# EAGLE schematic Dashboard_2.1 (EAGLE 9.2.2)

## Sheet 1 of 8: MCU
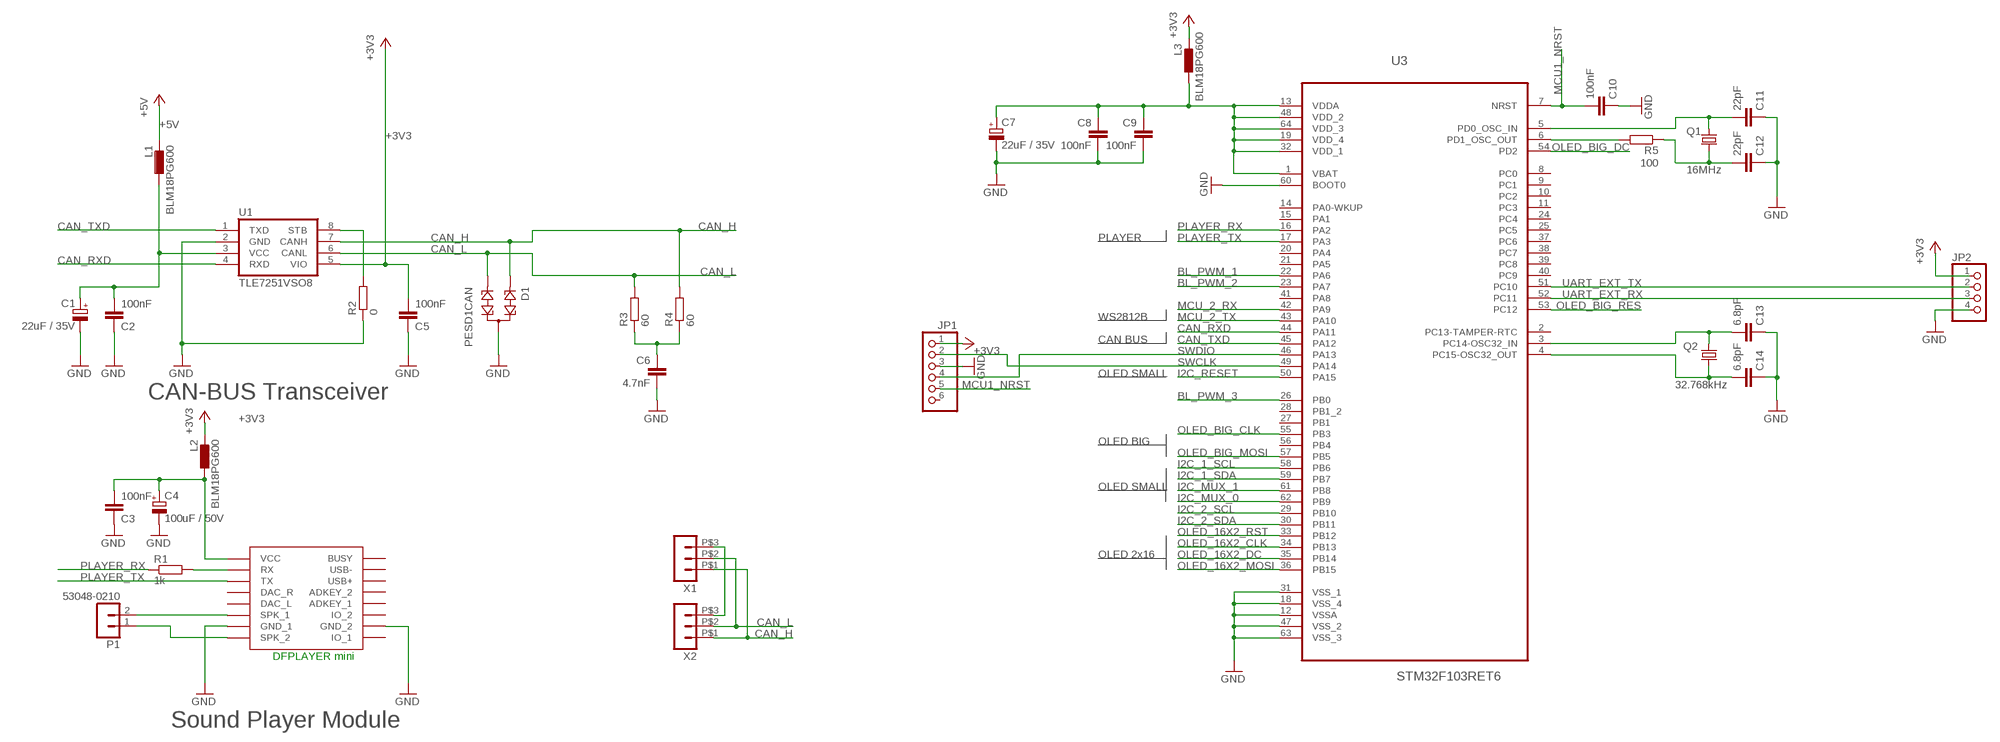
[diagram p0: schematic, sheet 1]

### Parts
C1  22uF / 35V  CPOL-EUSMCD  [SMC_D]
C2  100nF  C-EUC0805K  [C0805K]
C3  100nF  C-EUC0805K  [C0805K]
C4  100uF / 50V  CPOL-EUF  [PANASONIC_F]
C5  100nF  C-EUC0805K  [C0805K]
C6  4.7nF  C-EUC0805K  [C0805K]
C7  22uF / 35V  CPOL-EUSMCD  [SMC_D]
C8  100nF  C-EUC0805K  [C0805K]
C9  100nF  C-EUC0805K  [C0805K]
C10  100nF  C-EUC0805K  [C0805K]
C11  22pF  C-EUC0805K  [C0805K]
C12  22pF  C-EUC0805K  [C0805K]
C13  6.8pF  C-EUC0805K  [C0805K]
C14  6.8pF  C-EUC0805K  [C0805K]
D1  PESD1CAN  [SOT23]
JP1  PINHD-1X6  [1X06]
JP2  PINHD-1X4  [1X04]
L1  BLM18PG600  L_EU_L0603  [L1608]
L2  BLM18PG600  L_EU_L0603  [L1608]
L3  BLM18PG600  L_EU_L0603  [L1608]
P1  53048-0210  [53048-0210]
Q1  16MHz  CRYSTALSM49  [SM49]
Q2  32.768kHz  MC-306  [SMD4_270]
R1  1k  R-EU_R0805  [R0805]
R2  0  R-EU_R0805  [R0805]
R3  60  R-EU_R0805  [R0805]
R4  60  R-EU_R0805  [R0805]
R5  100  R-EU_R0805  [R0805]
U1  TLE7251VSO8  [SO8]
U2  DFPLAYER  [DFPLAYER]
U3  STM32F103RET6  [QFP50P1200X1200X160-64N]
X1  HEADER_POS3_43650-0315  [43650-0315]
X2  HEADER_POS3_43650-0315  [43650-0315]

### Nets
+3V3: C5.2 JP1.1 JP2.1 L2.2 L3.2 U1.5(VIO) ; also sheet 3,4,5,6,7,8
+5V: L1.2 ; also sheet 2,3,4,5
BL_PWM_1: U3.22(PA6) ; also sheet 3
BL_PWM_2: U3.23(PA7) ; also sheet 3
BL_PWM_3: U3.26(PB0) ; also sheet 3
CAN_H: D1.1 R4.2 U1.7(CANH) X1.P$1 X2.P$1
CAN_L: D1.2 R3.2 U1.6(CANL) X1.P$2 X2.P$2
CAN_RXD: U1.4(RXD) U3.44(PA11)
CAN_STB: R2.2 U1.8(STB)
CAN_TXD: U1.1(TXD) U3.45(PA12)
GND: C1.- C2.1 C3.1 C4.- C5.1 C6.2 C7.- C8.2 C9.2 C10.1 C11.1 C12.1 C13.1 C14.1 D1.3 JP1.3 JP2.4 R2.1 U1.2(GND) U2.GND_1 U2.GND_2 U3.12(VSSA) U3.18(VSS_4) U3.31(VSS_1) U3.47(VSS_2) U3.60(BOOT0) U3.63(VSS_3) ; also sheet 2,3,4,5,6,7,8
I2C_1_SCL: U3.58(PB6) ; also sheet 6
I2C_1_SDA: U3.59(PB7) ; also sheet 6
I2C_2_SCL: U3.29(PB10)
I2C_2_SDA: U3.30(PB11)
I2C_MUX_0: U3.62(PB9) ; also sheet 6
I2C_MUX_1: U3.61(PB8) ; also sheet 6
I2C_RESET: U3.50(PA15) ; also sheet 6
MCU1_NRST: C10.2 JP1.5 U3.7(NRST)
MCU_2_RX: U3.42(PA9) ; also sheet 5
MCU_2_TX: U3.43(PA10) ; also sheet 5
N$16: R5.2 U3.6(PD1_OSC_OUT)
N$22: R1.2 U2.RX
N$23: C3.2 C4.+ L2.1 U2.VCC
N$49: X1.P$3 X2.P$3
N$58: P1.1 U2.SPK2(SPK_2)
N$59: C6.1 R3.1 R4.1
N$61: C7.+ C8.1 C9.1 L3.1 U3.1(VBAT) U3.13(VDDA) U3.19(VDD_4) U3.32(VDD_1) U3.48(VDD_2) U3.64(VDD_3)
N$64: P1.2 U2.SPK1(SPK_1)
N$87: C11.2 Q1.1 U3.5(PD0_OSC_IN)
N$88: C12.2 Q1.2 R5.1
N$104: C13.2 Q2.4 U3.3(PC14-OSC32_IN)
N$108: C14.2 Q2.1 U3.4(PC15-OSC32_OUT)
N$113: C1.+ C2.2 L1.1 U1.3(VCC)
OLED_16X2_CLK: U3.34(PB13) ; also sheet 7
OLED_16X2_DC: U3.35(PB14) ; also sheet 7
OLED_16X2_MOSI: U3.36(PB15) ; also sheet 7
OLED_16X2_RST: U3.33(PB12) ; also sheet 7
OLED_BIG_CLK: U3.55(PB3) ; also sheet 8
OLED_BIG_DC: U3.54(PD2) ; also sheet 8
OLED_BIG_MOSI: U3.57(PB5) ; also sheet 8
OLED_BIG_RES: U3.53(PC12) ; also sheet 8
PLAYER_RX: R1.1 U3.16(PA2)
PLAYER_TX: U2.TX U3.17(PA3)
SWCLK: JP1.2 U3.49(PA14)
SWDIO: JP1.4 U3.46(PA13)
UART_EXT_RX: JP2.3 U3.52(PC11)
UART_EXT_TX: JP2.2 U3.51(PC10)
Unconnected: JP1.6 U2.ADKEY1(ADKEY_1) U2.ADKEY2(ADKEY_2) U2.BUSY U2.DAC_L U2.DAC_R U2.IO1(IO_1) U2.IO2(IO_2) U2.USB+ U2.USB- U3.2(PC13-TAMPER-RTC) U3.8(PC0) U3.9(PC1) U3.10(PC2) U3.11(PC3) U3.14(PA0-WKUP) U3.15(PA1) U3.20(PA4) U3.21(PA5) U3.24(PC4) U3.25(PC5) U3.27(PB1) U3.28(PB1_2) U3.37(PC6) U3.38(PC7) U3.39(PC8) U3.40(PC9) U3.41(PA8) U3.56(PB4)

### Notes on the sheet
- PLAYER
- WS2812B
- CAN BUS
- OLED SMALL
- CAN-BUS Transceiver
- OLED BIG
- OLED SMALL
- OLED 2x16
- DFPLAYER mini
- Sound Player Module

## Sheet 2 of 8: WS2812b arrays
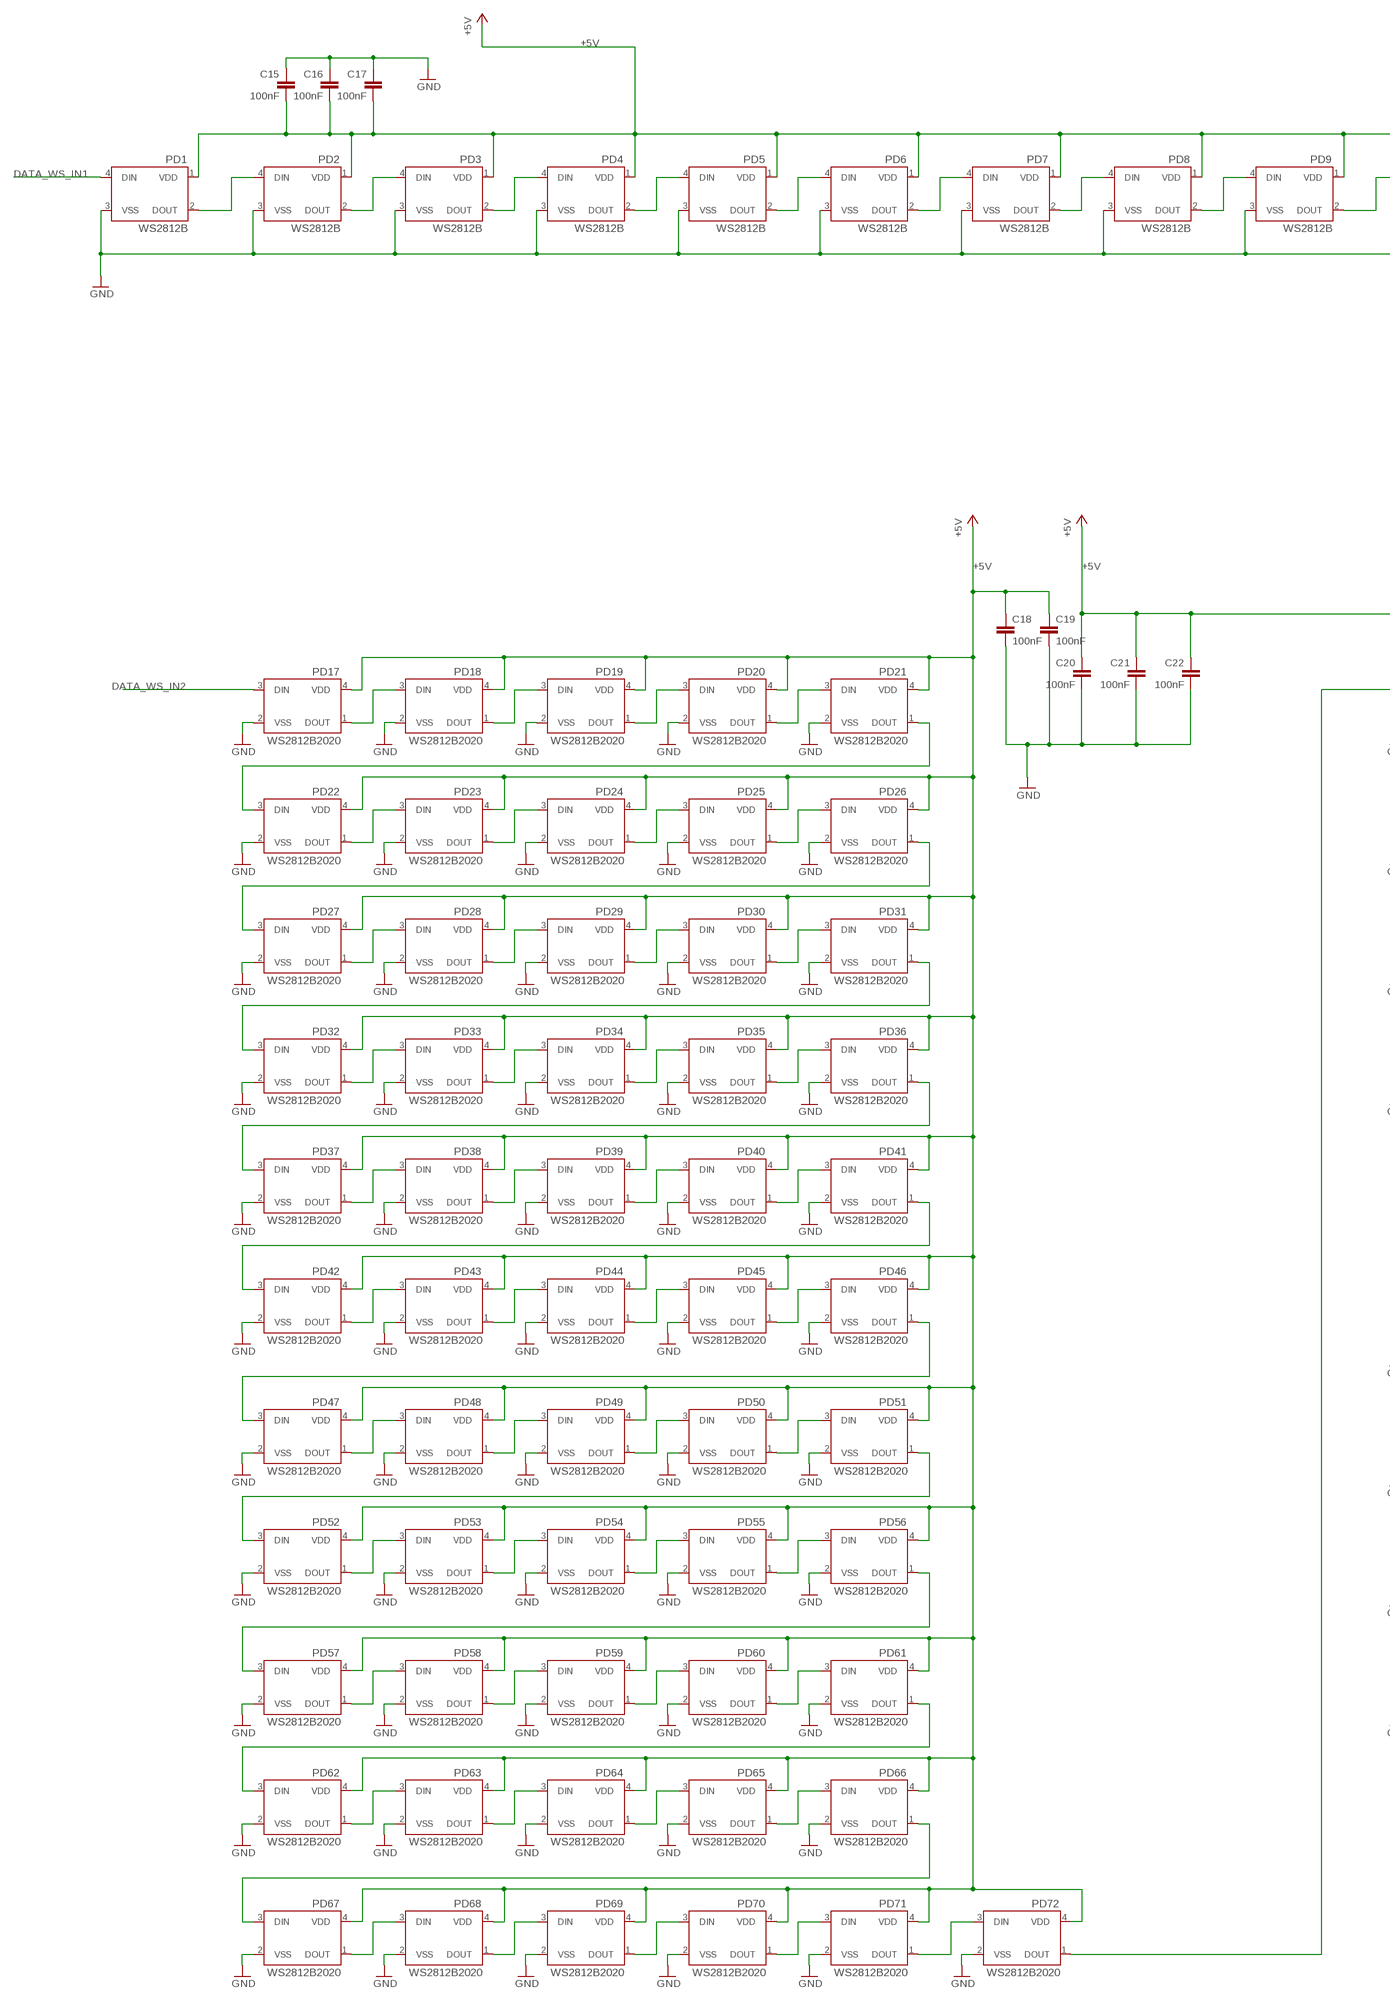
[diagram p1: schematic, sheet 2, part 1 of 2]
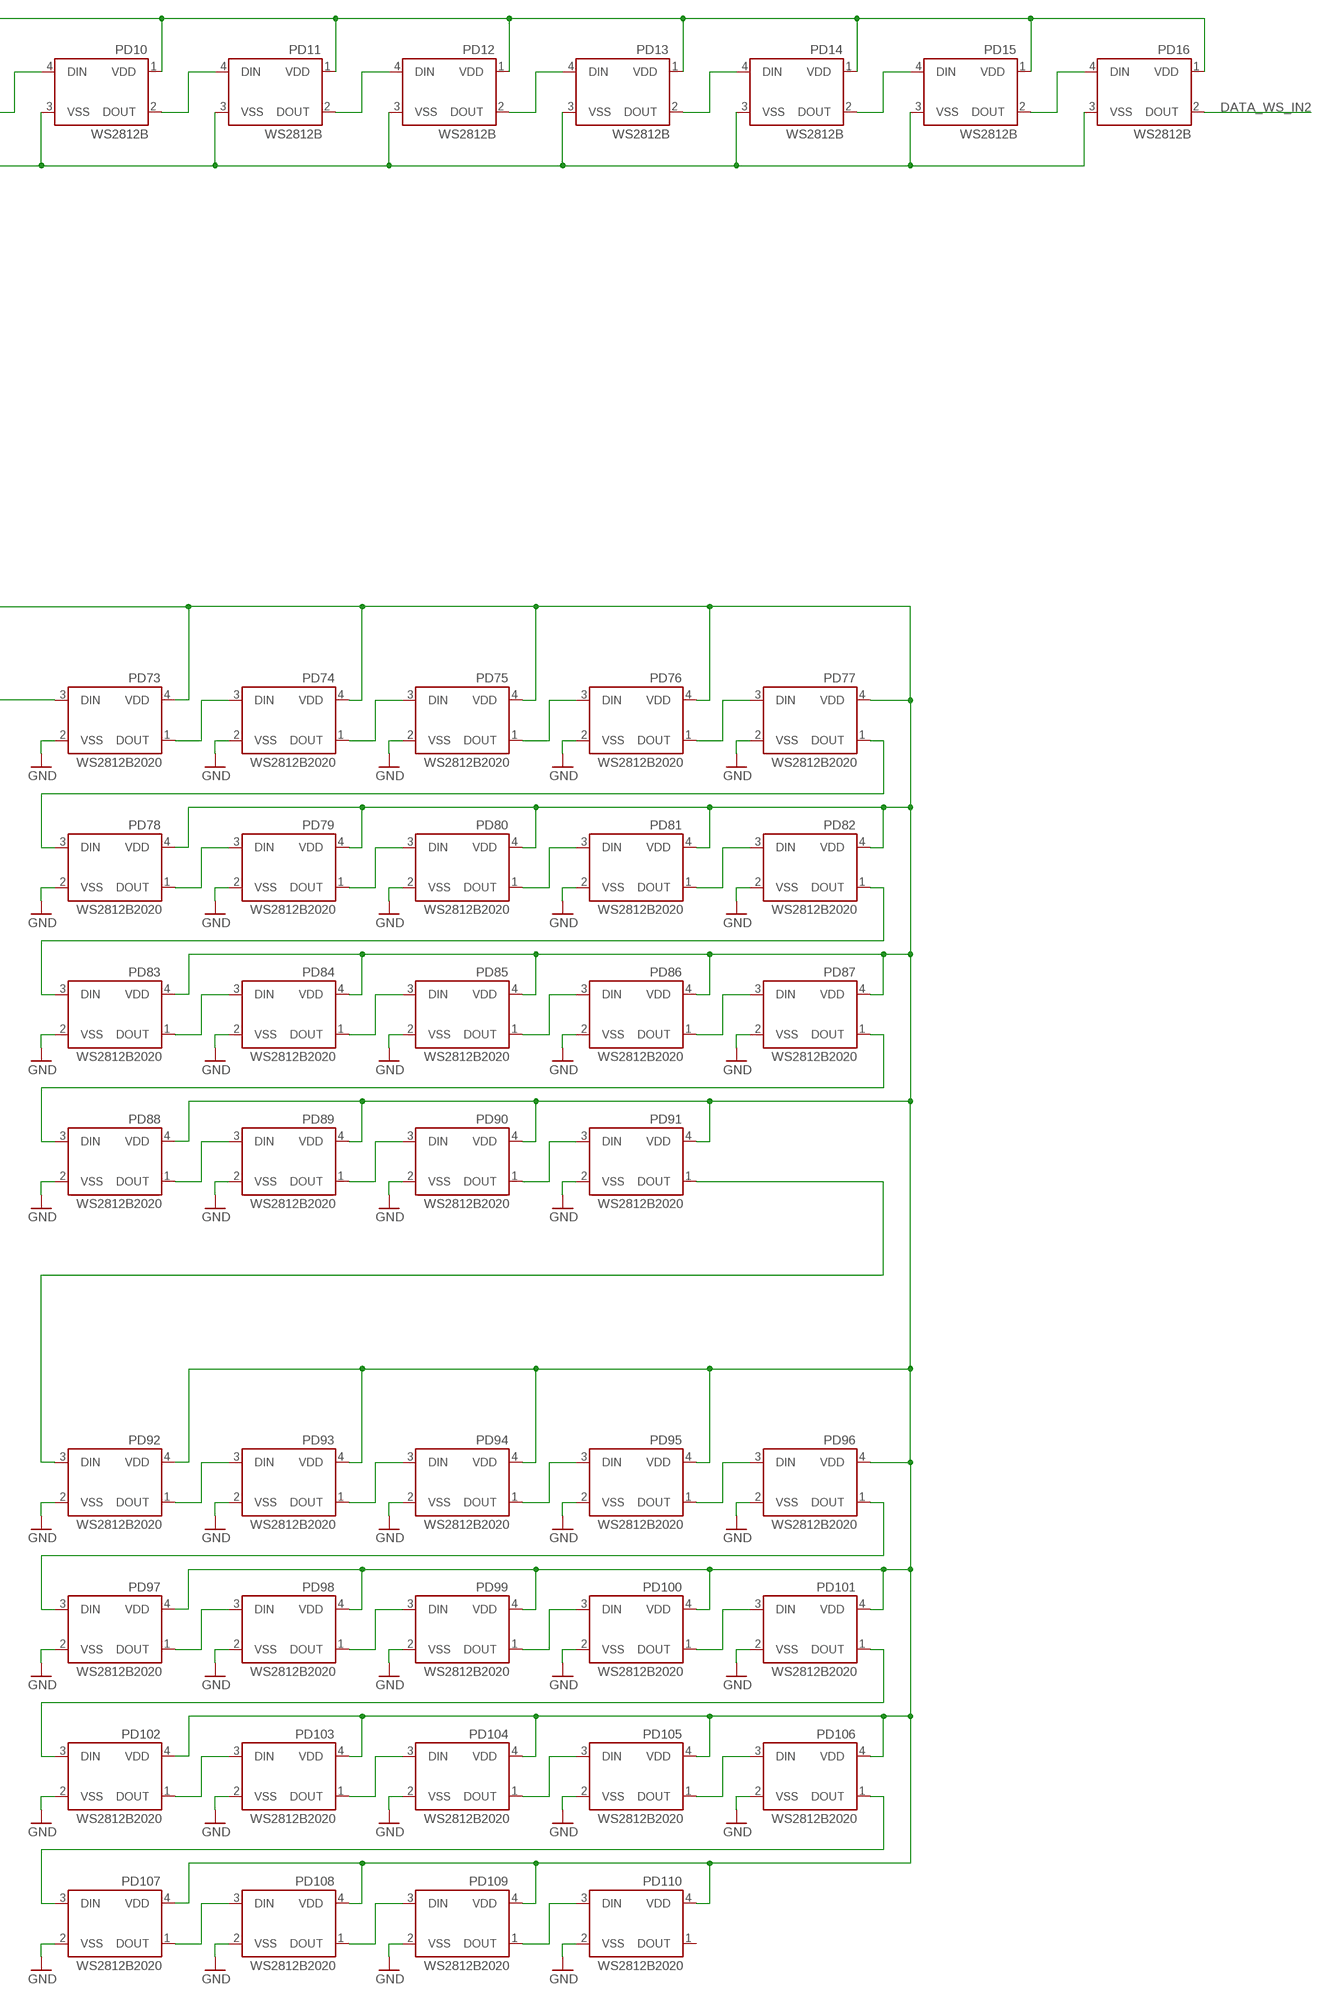
[diagram p2: schematic, sheet 2, part 2 of 2]

### Parts
C15  100nF  C-EUC0805K  [C0805K]
C16  100nF  C-EUC0805K  [C0805K]
C17  100nF  C-EUC0805K  [C0805K]
C18  100nF  C-EUC0805K  [C0805K]
C19  100nF  C-EUC0805K  [C0805K]
C20  100nF  C-EUC0805K  [C0805K]
C21  100nF  C-EUC0805K  [C0805K]
C22  100nF  C-EUC0805K  [C0805K]
PD1  WS2812B  [5050]
PD2  WS2812B  [5050]
PD3  WS2812B  [5050]
PD4  WS2812B  [5050]
PD5  WS2812B  [5050]
PD6  WS2812B  [5050]
PD7  WS2812B  [5050]
PD8  WS2812B  [5050]
PD9  WS2812B  [5050]
PD10  WS2812B  [5050]
PD11  WS2812B  [5050]
PD12  WS2812B  [5050]
PD13  WS2812B  [5050]
PD14  WS2812B  [5050]
PD15  WS2812B  [5050]
PD16  WS2812B  [5050]
PD17  WS2812B2020  [LED_WS2812-2020]
PD18  WS2812B2020  [LED_WS2812-2020]
PD19  WS2812B2020  [LED_WS2812-2020]
PD20  WS2812B2020  [LED_WS2812-2020]
PD21  WS2812B2020  [LED_WS2812-2020]
PD22  WS2812B2020  [LED_WS2812-2020]
PD23  WS2812B2020  [LED_WS2812-2020]
PD24  WS2812B2020  [LED_WS2812-2020]
PD25  WS2812B2020  [LED_WS2812-2020]
PD26  WS2812B2020  [LED_WS2812-2020]
PD27  WS2812B2020  [LED_WS2812-2020]
PD28  WS2812B2020  [LED_WS2812-2020]
PD29  WS2812B2020  [LED_WS2812-2020]
PD30  WS2812B2020  [LED_WS2812-2020]
PD31  WS2812B2020  [LED_WS2812-2020]
PD32  WS2812B2020  [LED_WS2812-2020]
PD33  WS2812B2020  [LED_WS2812-2020]
PD34  WS2812B2020  [LED_WS2812-2020]
PD35  WS2812B2020  [LED_WS2812-2020]
PD36  WS2812B2020  [LED_WS2812-2020]
PD37  WS2812B2020  [LED_WS2812-2020]
PD38  WS2812B2020  [LED_WS2812-2020]
PD39  WS2812B2020  [LED_WS2812-2020]
PD40  WS2812B2020  [LED_WS2812-2020]
PD41  WS2812B2020  [LED_WS2812-2020]
PD42  WS2812B2020  [LED_WS2812-2020]
PD43  WS2812B2020  [LED_WS2812-2020]
PD44  WS2812B2020  [LED_WS2812-2020]
PD45  WS2812B2020  [LED_WS2812-2020]
PD46  WS2812B2020  [LED_WS2812-2020]
PD47  WS2812B2020  [LED_WS2812-2020]
PD48  WS2812B2020  [LED_WS2812-2020]
PD49  WS2812B2020  [LED_WS2812-2020]
PD50  WS2812B2020  [LED_WS2812-2020]
PD51  WS2812B2020  [LED_WS2812-2020]
PD52  WS2812B2020  [LED_WS2812-2020]
PD53  WS2812B2020  [LED_WS2812-2020]
PD54  WS2812B2020  [LED_WS2812-2020]
PD55  WS2812B2020  [LED_WS2812-2020]
PD56  WS2812B2020  [LED_WS2812-2020]
PD57  WS2812B2020  [LED_WS2812-2020]
PD58  WS2812B2020  [LED_WS2812-2020]
PD59  WS2812B2020  [LED_WS2812-2020]
PD60  WS2812B2020  [LED_WS2812-2020]
PD61  WS2812B2020  [LED_WS2812-2020]
PD62  WS2812B2020  [LED_WS2812-2020]
PD63  WS2812B2020  [LED_WS2812-2020]
PD64  WS2812B2020  [LED_WS2812-2020]
PD65  WS2812B2020  [LED_WS2812-2020]
PD66  WS2812B2020  [LED_WS2812-2020]
PD67  WS2812B2020  [LED_WS2812-2020]
PD68  WS2812B2020  [LED_WS2812-2020]
PD69  WS2812B2020  [LED_WS2812-2020]
PD70  WS2812B2020  [LED_WS2812-2020]
PD71  WS2812B2020  [LED_WS2812-2020]
PD72  WS2812B2020  [LED_WS2812-2020]
PD73  WS2812B2020  [LED_WS2812-2020]
PD74  WS2812B2020  [LED_WS2812-2020]
PD75  WS2812B2020  [LED_WS2812-2020]
PD76  WS2812B2020  [LED_WS2812-2020]
PD77  WS2812B2020  [LED_WS2812-2020]
PD78  WS2812B2020  [LED_WS2812-2020]
PD79  WS2812B2020  [LED_WS2812-2020]
PD80  WS2812B2020  [LED_WS2812-2020]
PD81  WS2812B2020  [LED_WS2812-2020]
PD82  WS2812B2020  [LED_WS2812-2020]
PD83  WS2812B2020  [LED_WS2812-2020]
PD84  WS2812B2020  [LED_WS2812-2020]
PD85  WS2812B2020  [LED_WS2812-2020]
PD86  WS2812B2020  [LED_WS2812-2020]
PD87  WS2812B2020  [LED_WS2812-2020]
PD88  WS2812B2020  [LED_WS2812-2020]
PD89  WS2812B2020  [LED_WS2812-2020]
PD90  WS2812B2020  [LED_WS2812-2020]
PD91  WS2812B2020  [LED_WS2812-2020]
PD92  WS2812B2020  [LED_WS2812-2020]
PD93  WS2812B2020  [LED_WS2812-2020]
PD94  WS2812B2020  [LED_WS2812-2020]
PD95  WS2812B2020  [LED_WS2812-2020]
PD96  WS2812B2020  [LED_WS2812-2020]
PD97  WS2812B2020  [LED_WS2812-2020]
PD98  WS2812B2020  [LED_WS2812-2020]
PD99  WS2812B2020  [LED_WS2812-2020]
PD100  WS2812B2020  [LED_WS2812-2020]
PD101  WS2812B2020  [LED_WS2812-2020]
PD102  WS2812B2020  [LED_WS2812-2020]
PD103  WS2812B2020  [LED_WS2812-2020]
PD104  WS2812B2020  [LED_WS2812-2020]
PD105  WS2812B2020  [LED_WS2812-2020]
PD106  WS2812B2020  [LED_WS2812-2020]
PD107  WS2812B2020  [LED_WS2812-2020]
PD108  WS2812B2020  [LED_WS2812-2020]
PD109  WS2812B2020  [LED_WS2812-2020]
PD110  WS2812B2020  [LED_WS2812-2020]

### Nets
+5V: C15.2 C16.2 C17.2 C18.1 C19.1 C20.1 C21.1 C22.1 PD1.1(VDD) PD2.1(VDD) PD3.1(VDD) PD4.1(VDD) PD5.1(VDD) PD6.1(VDD) PD7.1(VDD) PD8.1(VDD) PD9.1(VDD) PD10.1(VDD) PD11.1(VDD) PD12.1(VDD) PD13.1(VDD) PD14.1(VDD) PD15.1(VDD) PD16.1(VDD) PD17.4(VDD) PD18.4(VDD) PD19.4(VDD) PD20.4(VDD) PD21.4(VDD) PD22.4(VDD) PD23.4(VDD) PD24.4(VDD) PD25.4(VDD) PD26.4(VDD) PD27.4(VDD) PD28.4(VDD) PD29.4(VDD) PD30.4(VDD) PD31.4(VDD) PD32.4(VDD) PD33.4(VDD) PD34.4(VDD) PD35.4(VDD) PD36.4(VDD) PD37.4(VDD) PD38.4(VDD) PD39.4(VDD) PD40.4(VDD) PD41.4(VDD) PD42.4(VDD) PD43.4(VDD) PD44.4(VDD) PD45.4(VDD) PD46.4(VDD) PD47.4(VDD) PD48.4(VDD) PD49.4(VDD) PD50.4(VDD) PD51.4(VDD) PD52.4(VDD) PD53.4(VDD) PD54.4(VDD) PD55.4(VDD) PD56.4(VDD) PD57.4(VDD) PD58.4(VDD) PD59.4(VDD) PD60.4(VDD) PD61.4(VDD) PD62.4(VDD) PD63.4(VDD) PD64.4(VDD) PD65.4(VDD) PD66.4(VDD) PD67.4(VDD) PD68.4(VDD) PD69.4(VDD) PD70.4(VDD) PD71.4(VDD) PD72.4(VDD) PD73.4(VDD) PD74.4(VDD) PD75.4(VDD) PD76.4(VDD) PD77.4(VDD) PD78.4(VDD) PD79.4(VDD) PD80.4(VDD) PD81.4(VDD) PD82.4(VDD) PD83.4(VDD) PD84.4(VDD) PD85.4(VDD) PD86.4(VDD) PD87.4(VDD) PD88.4(VDD) PD89.4(VDD) PD90.4(VDD) PD91.4(VDD) PD92.4(VDD) PD93.4(VDD) PD94.4(VDD) PD95.4(VDD) PD96.4(VDD) PD97.4(VDD) PD98.4(VDD) PD99.4(VDD) PD100.4(VDD) PD101.4(VDD) PD102.4(VDD) PD103.4(VDD) PD104.4(VDD) PD105.4(VDD) PD106.4(VDD) PD107.4(VDD) PD108.4(VDD) PD109.4(VDD) PD110.4(VDD) ; also sheet 1,3,4,5
DATA_WS_IN1: PD1.4(DIN) ; also sheet 5
DATA_WS_IN2: PD16.2(DOUT) PD17.3(DIN)
DATA_WS_IN3: PD72.1(DOUT) PD73.3(DIN)
GND: C15.1 C16.1 C17.1 C18.2 C19.2 C20.2 C21.2 C22.2 PD1.3(VSS) PD2.3(VSS) PD3.3(VSS) PD4.3(VSS) PD5.3(VSS) PD6.3(VSS) PD7.3(VSS) PD8.3(VSS) PD9.3(VSS) PD10.3(VSS) PD11.3(VSS) PD12.3(VSS) PD13.3(VSS) PD14.3(VSS) PD15.3(VSS) PD16.3(VSS) PD17.2(VSS) PD18.2(VSS) PD19.2(VSS) PD20.2(VSS) PD21.2(VSS) PD22.2(VSS) PD23.2(VSS) PD24.2(VSS) PD25.2(VSS) PD26.2(VSS) PD27.2(VSS) PD28.2(VSS) PD29.2(VSS) PD30.2(VSS) PD31.2(VSS) PD32.2(VSS) PD33.2(VSS) PD34.2(VSS) PD35.2(VSS) PD36.2(VSS) PD37.2(VSS) PD38.2(VSS) PD39.2(VSS) PD40.2(VSS) PD41.2(VSS) PD42.2(VSS) PD43.2(VSS) PD44.2(VSS) PD45.2(VSS) PD46.2(VSS) PD47.2(VSS) PD48.2(VSS) PD49.2(VSS) PD50.2(VSS) PD51.2(VSS) PD52.2(VSS) PD53.2(VSS) PD54.2(VSS) PD55.2(VSS) PD56.2(VSS) PD57.2(VSS) PD58.2(VSS) PD59.2(VSS) PD60.2(VSS) PD61.2(VSS) PD62.2(VSS) PD63.2(VSS) PD64.2(VSS) PD65.2(VSS) PD66.2(VSS) PD67.2(VSS) PD68.2(VSS) PD69.2(VSS) PD70.2(VSS) PD71.2(VSS) PD72.2(VSS) PD73.2(VSS) PD74.2(VSS) PD75.2(VSS) PD76.2(VSS) PD77.2(VSS) PD78.2(VSS) PD79.2(VSS) PD80.2(VSS) PD81.2(VSS) PD82.2(VSS) PD83.2(VSS) PD84.2(VSS) PD85.2(VSS) PD86.2(VSS) PD87.2(VSS) PD88.2(VSS) PD89.2(VSS) PD90.2(VSS) PD91.2(VSS) PD92.2(VSS) PD93.2(VSS) PD94.2(VSS) PD95.2(VSS) PD96.2(VSS) PD97.2(VSS) PD98.2(VSS) PD99.2(VSS) PD100.2(VSS) PD101.2(VSS) PD102.2(VSS) PD103.2(VSS) PD104.2(VSS) PD105.2(VSS) PD106.2(VSS) PD107.2(VSS) PD108.2(VSS) PD109.2(VSS) PD110.2(VSS) ; also sheet 1,3,4,5,6,7,8
N$2: PD1.2(DOUT) PD2.4(DIN)
N$3: PD2.2(DOUT) PD3.4(DIN)
N$4: PD3.2(DOUT) PD4.4(DIN)
N$9: PD4.2(DOUT) PD5.4(DIN)
N$10: PD5.2(DOUT) PD6.4(DIN)
N$12: PD6.2(DOUT) PD7.4(DIN)
N$14: PD7.2(DOUT) PD8.4(DIN)
N$15: PD9.2(DOUT) PD10.4(DIN)
N$17: PD10.2(DOUT) PD11.4(DIN)
N$18: PD11.2(DOUT) PD12.4(DIN)
N$19: PD12.2(DOUT) PD13.4(DIN)
N$25: PD13.2(DOUT) PD14.4(DIN)
N$26: PD14.2(DOUT) PD15.4(DIN)
N$27: PD15.2(DOUT) PD16.4(DIN)
N$28: PD8.2(DOUT) PD9.4(DIN)
N$57: PD21.1(DOUT) PD22.3(DIN)
N$117: PD17.1(DOUT) PD18.3(DIN)
N$118: PD18.1(DOUT) PD19.3(DIN)
N$121: PD19.1(DOUT) PD20.3(DIN)
N$122: PD20.1(DOUT) PD21.3(DIN)
N$123: PD22.1(DOUT) PD23.3(DIN)
N$125: PD23.1(DOUT) PD24.3(DIN)
N$126: PD24.1(DOUT) PD25.3(DIN)
N$127: PD25.1(DOUT) PD26.3(DIN)
N$128: PD26.1(DOUT) PD27.3(DIN)
N$129: PD27.1(DOUT) PD28.3(DIN)
N$130: PD28.1(DOUT) PD29.3(DIN)
N$131: PD29.1(DOUT) PD30.3(DIN)
N$132: PD30.1(DOUT) PD31.3(DIN)
N$133: PD31.1(DOUT) PD32.3(DIN)
N$134: PD32.1(DOUT) PD33.3(DIN)
N$135: PD33.1(DOUT) PD34.3(DIN)
N$136: PD34.1(DOUT) PD35.3(DIN)
N$137: PD35.1(DOUT) PD36.3(DIN)
N$138: PD36.1(DOUT) PD37.3(DIN)
N$139: PD37.1(DOUT) PD38.3(DIN)
N$140: PD38.1(DOUT) PD39.3(DIN)
N$141: PD39.1(DOUT) PD40.3(DIN)
N$142: PD40.1(DOUT) PD41.3(DIN)
N$143: PD41.1(DOUT) PD42.3(DIN)
N$144: PD42.1(DOUT) PD43.3(DIN)
N$145: PD43.1(DOUT) PD44.3(DIN)
N$146: PD44.1(DOUT) PD45.3(DIN)
N$147: PD45.1(DOUT) PD46.3(DIN)
N$148: PD46.1(DOUT) PD47.3(DIN)
N$149: PD47.1(DOUT) PD48.3(DIN)
N$150: PD48.1(DOUT) PD49.3(DIN)
N$151: PD49.1(DOUT) PD50.3(DIN)
N$152: PD50.1(DOUT) PD51.3(DIN)
N$153: PD51.1(DOUT) PD52.3(DIN)
N$154: PD52.1(DOUT) PD53.3(DIN)
N$155: PD53.1(DOUT) PD54.3(DIN)
N$156: PD54.1(DOUT) PD55.3(DIN)
N$157: PD55.1(DOUT) PD56.3(DIN)
N$158: PD56.1(DOUT) PD57.3(DIN)
N$159: PD57.1(DOUT) PD58.3(DIN)
N$160: PD58.1(DOUT) PD59.3(DIN)
N$161: PD59.1(DOUT) PD60.3(DIN)
N$162: PD60.1(DOUT) PD61.3(DIN)
N$163: PD61.1(DOUT) PD62.3(DIN)
N$164: PD62.1(DOUT) PD63.3(DIN)
N$165: PD63.1(DOUT) PD64.3(DIN)
N$166: PD64.1(DOUT) PD65.3(DIN)
N$167: PD65.1(DOUT) PD66.3(DIN)
N$169: PD66.1(DOUT) PD67.3(DIN)
N$170: PD92.1(DOUT) PD93.3(DIN)
N$171: PD67.1(DOUT) PD68.3(DIN)
N$172: PD68.1(DOUT) PD69.3(DIN)
N$173: PD69.1(DOUT) PD70.3(DIN)
N$174: PD70.1(DOUT) PD71.3(DIN)
N$175: PD71.1(DOUT) PD72.3(DIN)
N$176: PD93.1(DOUT) PD94.3(DIN)
N$178: PD94.1(DOUT) PD95.3(DIN)
N$179: PD95.1(DOUT) PD96.3(DIN)
N$180: PD73.1(DOUT) PD74.3(DIN)
N$181: PD74.1(DOUT) PD75.3(DIN)
N$182: PD75.1(DOUT) PD76.3(DIN)
N$183: PD76.1(DOUT) PD77.3(DIN)
N$184: PD77.1(DOUT) PD78.3(DIN)
N$185: PD78.1(DOUT) PD79.3(DIN)
N$186: PD79.1(DOUT) PD80.3(DIN)
N$187: PD80.1(DOUT) PD81.3(DIN)
N$188: PD81.1(DOUT) PD82.3(DIN)
N$189: PD82.1(DOUT) PD83.3(DIN)
N$190: PD83.1(DOUT) PD84.3(DIN)
N$191: PD84.1(DOUT) PD85.3(DIN)
N$192: PD85.1(DOUT) PD86.3(DIN)
N$193: PD86.1(DOUT) PD87.3(DIN)
N$194: PD87.1(DOUT) PD88.3(DIN)
N$195: PD88.1(DOUT) PD89.3(DIN)
N$196: PD89.1(DOUT) PD90.3(DIN)
N$197: PD90.1(DOUT) PD91.3(DIN)
N$198: PD91.1(DOUT) PD92.3(DIN)
N$199: PD96.1(DOUT) PD97.3(DIN)
N$200: PD97.1(DOUT) PD98.3(DIN)
N$201: PD98.1(DOUT) PD99.3(DIN)
N$202: PD99.1(DOUT) PD100.3(DIN)
N$203: PD100.1(DOUT) PD101.3(DIN)
N$204: PD101.1(DOUT) PD102.3(DIN)
N$205: PD102.1(DOUT) PD103.3(DIN)
N$206: PD103.1(DOUT) PD104.3(DIN)
N$207: PD104.1(DOUT) PD105.3(DIN)
N$208: PD105.1(DOUT) PD106.3(DIN)
N$209: PD106.1(DOUT) PD107.3(DIN)
N$210: PD107.1(DOUT) PD108.3(DIN)
N$211: PD108.1(DOUT) PD109.3(DIN)
N$212: PD109.1(DOUT) PD110.3(DIN)
Unconnected: PD110.1(DOUT)

## Sheet 3 of 8: backlight
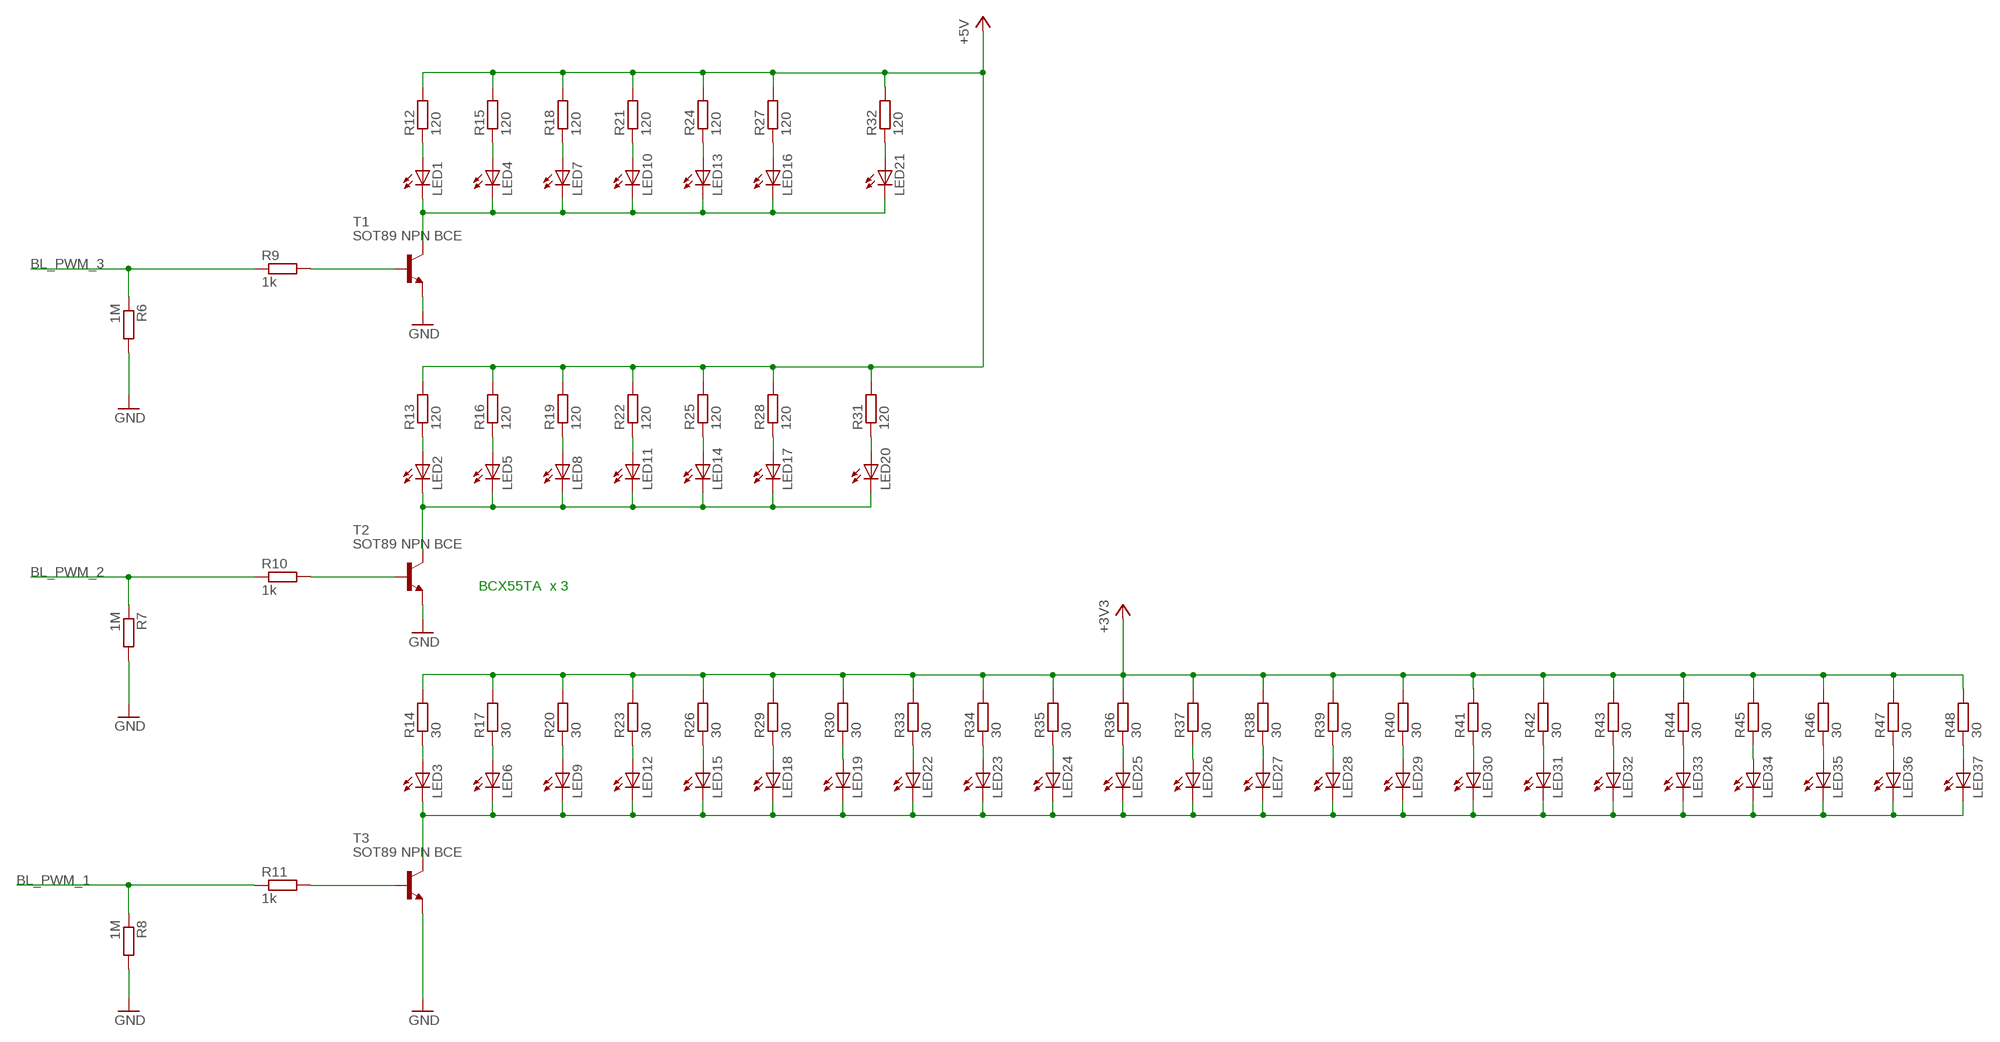
[diagram p3: schematic, sheet 3]

### Parts
LED1  LEDCHIPLED_0603  [CHIPLED_0603]
LED2  LEDCHIPLED_0603  [CHIPLED_0603]
LED3  LEDCHIPLED_0603  [CHIPLED_0603]
LED4  LEDCHIPLED_0603  [CHIPLED_0603]
LED5  LEDCHIPLED_0603  [CHIPLED_0603]
LED6  LEDCHIPLED_0603  [CHIPLED_0603]
LED7  LEDCHIPLED_0603  [CHIPLED_0603]
LED8  LEDCHIPLED_0603  [CHIPLED_0603]
LED9  LEDCHIPLED_0603  [CHIPLED_0603]
LED10  LEDCHIPLED_0603  [CHIPLED_0603]
LED11  LEDCHIPLED_0603  [CHIPLED_0603]
LED12  LEDCHIPLED_0603  [CHIPLED_0603]
LED13  LEDCHIPLED_0603  [CHIPLED_0603]
LED14  LEDCHIPLED_0603  [CHIPLED_0603]
LED15  LEDCHIPLED_0603  [CHIPLED_0603]
LED16  LEDCHIPLED_0603  [CHIPLED_0603]
LED17  LEDCHIPLED_0603  [CHIPLED_0603]
LED18  LEDCHIPLED_0603  [CHIPLED_0603]
LED19  LEDCHIPLED_0603  [CHIPLED_0603]
LED20  LEDCHIPLED_0603  [CHIPLED_0603]
LED21  LEDCHIPLED_0603  [CHIPLED_0603]
LED22  LEDCHIPLED_0603  [CHIPLED_0603]
LED23  LEDCHIPLED_0603  [CHIPLED_0603]
LED24  LEDCHIPLED_0603  [CHIPLED_0603]
LED25  LEDCHIPLED_0603  [CHIPLED_0603]
LED26  LEDCHIPLED_0603  [CHIPLED_0603]
LED27  LEDCHIPLED_0603  [CHIPLED_0603]
LED28  LEDCHIPLED_0603  [CHIPLED_0603]
LED29  LEDCHIPLED_0603  [CHIPLED_0603]
LED30  LEDCHIPLED_0603  [CHIPLED_0603]
LED31  LEDCHIPLED_0603  [CHIPLED_0603]
LED32  LEDCHIPLED_0603  [CHIPLED_0603]
LED33  LEDCHIPLED_0603  [CHIPLED_0603]
LED34  LEDCHIPLED_0603  [CHIPLED_0603]
LED35  LEDCHIPLED_0603  [CHIPLED_0603]
LED36  LEDCHIPLED_0603  [CHIPLED_0603]
LED37  LEDCHIPLED_0603  [CHIPLED_0603]
R6  1M  R-EU_R0805  [R0805]
R7  1M  R-EU_R0805  [R0805]
R8  1M  R-EU_R0805  [R0805]
R9  1k  R-EU_R0805  [R0805]
R10  1k  R-EU_R0805  [R0805]
R11  1k  R-EU_R0805  [R0805]
R12  120  R-EU_R0805  [R0805]
R13  120  R-EU_R0805  [R0805]
R14  30  R-EU_R0805  [R0805]
R15  120  R-EU_R0805  [R0805]
R16  120  R-EU_R0805  [R0805]
R17  30  R-EU_R0805  [R0805]
R18  120  R-EU_R0805  [R0805]
R19  120  R-EU_R0805  [R0805]
R20  30  R-EU_R0805  [R0805]
R21  120  R-EU_R0805  [R0805]
R22  120  R-EU_R0805  [R0805]
R23  30  R-EU_R0805  [R0805]
R24  120  R-EU_R0805  [R0805]
R25  120  R-EU_R0805  [R0805]
R26  30  R-EU_R0805  [R0805]
R27  120  R-EU_R0805  [R0805]
R28  120  R-EU_R0805  [R0805]
R29  30  R-EU_R0805  [R0805]
R30  30  R-EU_R0805  [R0805]
R31  120  R-EU_R0805  [R0805]
R32  120  R-EU_R0805  [R0805]
R33  30  R-EU_R0805  [R0805]
R34  30  R-EU_R0805  [R0805]
R35  30  R-EU_R0805  [R0805]
R36  30  R-EU_R0805  [R0805]
R37  30  R-EU_R0805  [R0805]
R38  30  R-EU_R0805  [R0805]
R39  30  R-EU_R0805  [R0805]
R40  30  R-EU_R0805  [R0805]
R41  30  R-EU_R0805  [R0805]
R42  30  R-EU_R0805  [R0805]
R43  30  R-EU_R0805  [R0805]
R44  30  R-EU_R0805  [R0805]
R45  30  R-EU_R0805  [R0805]
R46  30  R-EU_R0805  [R0805]
R47  30  R-EU_R0805  [R0805]
R48  30  R-EU_R0805  [R0805]
T1  SOT89 NPN BCE  -NPN-SOT89-BCE  [SOT89-BCE]
T2  SOT89 NPN BCE  -NPN-SOT89-BCE  [SOT89-BCE]
T3  SOT89 NPN BCE  -NPN-SOT89-BCE  [SOT89-BCE]

### Nets
+3V3: R14.2 R17.2 R20.2 R23.2 R26.2 R29.2 R30.2 R33.2 R34.2 R35.2 R36.2 R37.2 R38.2 R39.2 R40.2 R41.2 R42.2 R43.2 R44.2 R45.2 R46.2 R47.2 R48.2 ; also sheet 1,4,5,6,7,8
+5V: R12.2 R13.2 R15.2 R16.2 R18.2 R19.2 R21.2 R22.2 R24.2 R25.2 R27.2 R28.2 R31.2 R32.2 ; also sheet 1,2,4,5
BL_PWM_1: R8.1 R11.1 ; also sheet 1
BL_PWM_2: R7.1 R10.1 ; also sheet 1
BL_PWM_3: R6.1 R9.1 ; also sheet 1
GND: R6.2 R7.2 R8.2 T1.E T2.E T3.E ; also sheet 1,2,4,5,6,7,8
N$1: LED1.C LED4.C LED7.C LED10.C LED13.C LED16.C LED21.C T1.C
N$5: LED2.C LED5.C LED8.C LED11.C LED14.C LED17.C LED20.C T2.C
N$6: R9.2 T1.B
N$7: R10.2 T2.B
N$29: R11.2 T3.B
N$31: LED1.A R12.1
N$32: LED4.A R15.1
N$33: LED7.A R18.1
N$34: LED10.A R21.1
N$35: LED13.A R24.1
N$37: LED16.A R27.1
N$38: LED23.A R34.1
N$39: LED24.A R35.1
N$40: LED25.A R36.1
N$41: LED26.A R37.1
N$42: LED27.A R38.1
N$43: LED28.A R39.1
N$44: LED29.A R40.1
N$45: LED3.C LED6.C LED9.C LED12.C LED15.C LED18.C LED19.C LED22.C LED23.C LED24.C LED25.C LED26.C LED27.C LED28.C LED29.C LED30.C LED31.C LED32.C LED33.C LED34.C LED35.C LED36.C LED37.C T3.C
N$47: LED3.A R14.1
N$50: LED2.A R13.1
N$51: LED5.A R16.1
N$52: LED8.A R19.1
N$53: LED11.A R22.1
N$54: LED14.A R25.1
N$55: LED17.A R28.1
N$56: LED30.A R41.1
N$60: LED21.A R32.1
N$62: LED20.A R31.1
N$65: LED6.A R17.1
N$66: LED9.A R20.1
N$67: LED12.A R23.1
N$68: LED31.A R42.1
N$69: LED15.A R26.1
N$70: LED18.A R29.1
N$71: LED19.A R30.1
N$72: LED22.A R33.1
N$73: LED32.A R43.1
N$74: LED33.A R44.1
N$75: LED34.A R45.1
N$76: LED35.A R46.1
N$80: LED36.A R47.1
N$81: LED37.A R48.1

### Notes on the sheet
- BCX55TA  x 3

## Sheet 4 of 8: power supply
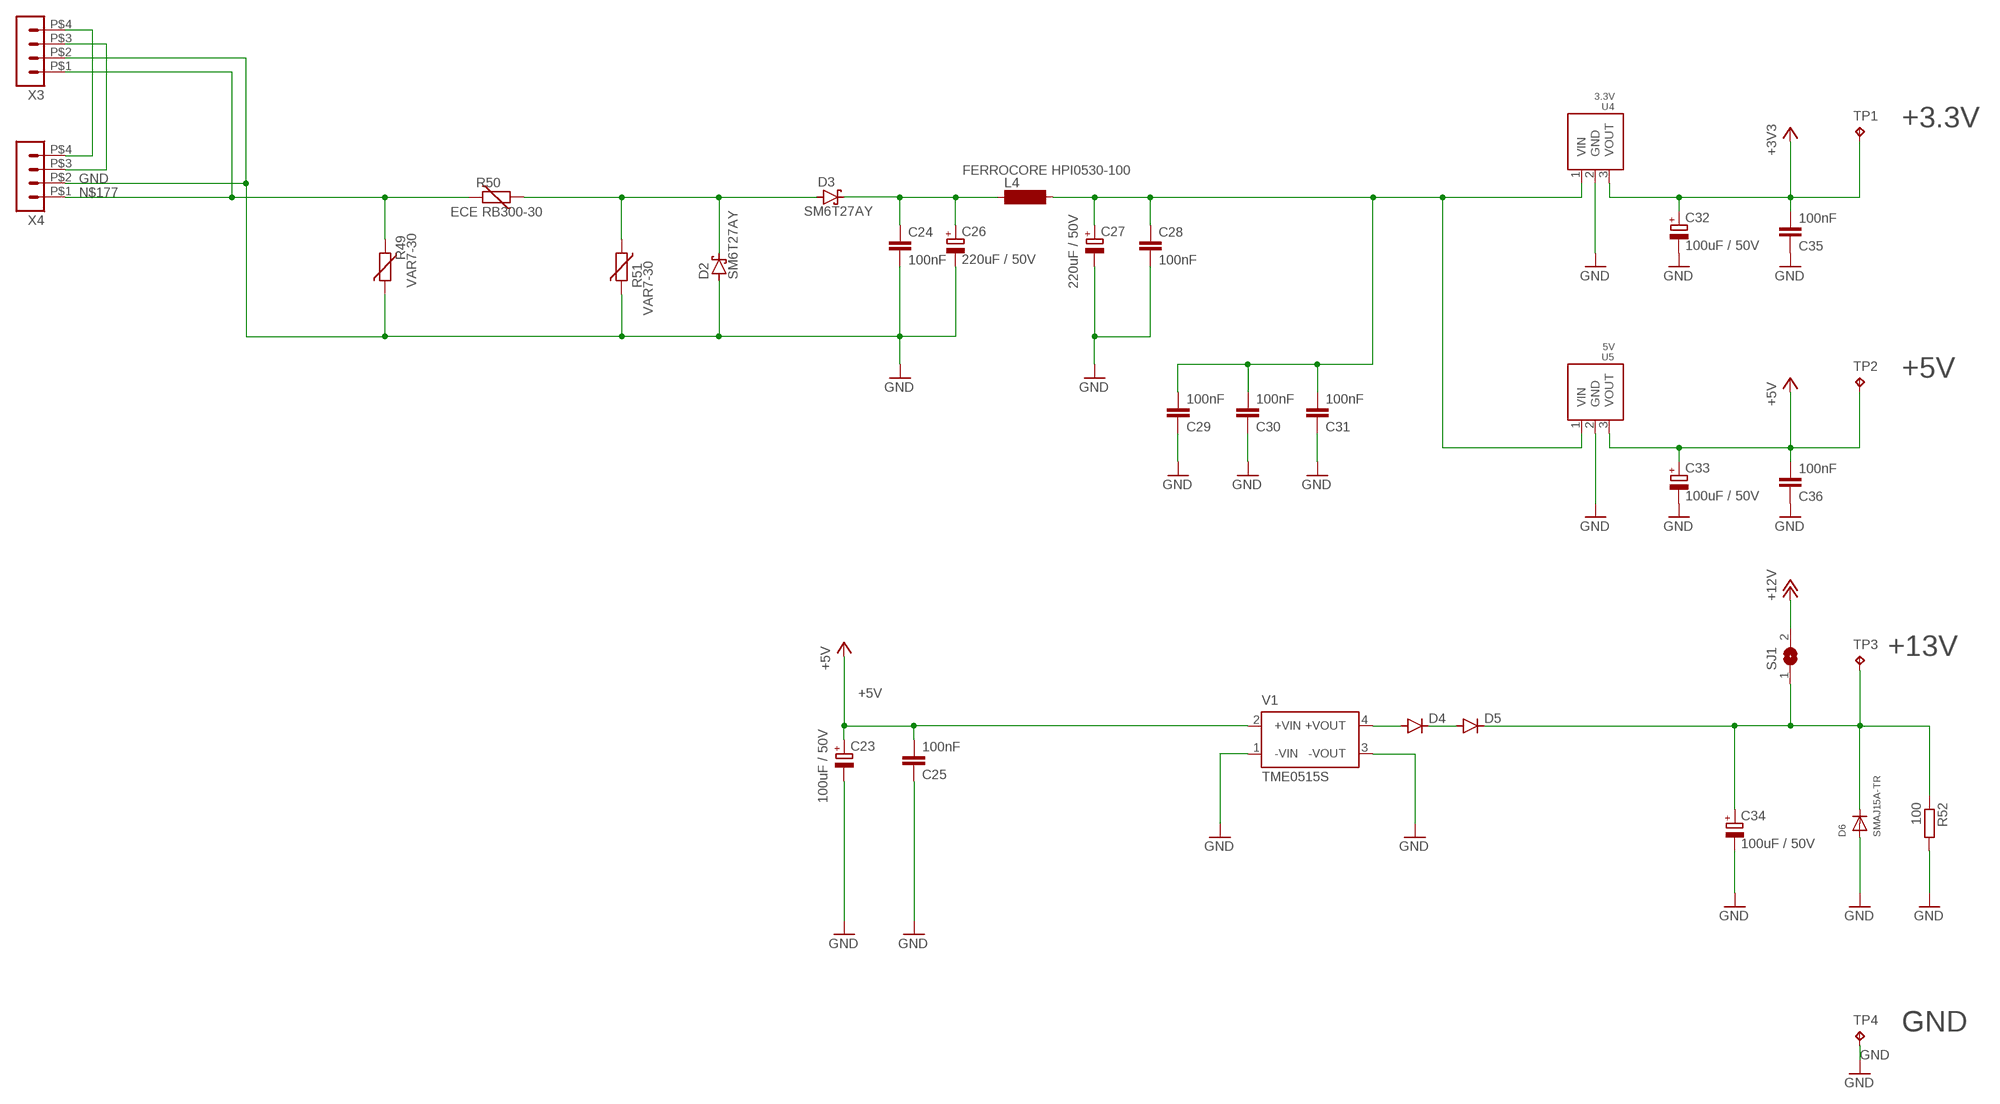
[diagram p4: schematic, sheet 4]

### Parts
C23  100uF / 50V  CPOL-EUF  [PANASONIC_F]
C24  100nF  C-EUC1206K  [C1206K]
C25  100nF  C-EUC0805K  [C0805K]
C26  220uF / 50V  CPOL-EUG  [PANASONIC_G]
C27  220uF / 50V  CPOL-EUG  [PANASONIC_G]
C28  100nF  C-EUC1206K  [C1206K]
C29  100nF  C-EUC0805K  [C0805K]
C30  100nF  C-EUC0805K  [C0805K]
C31  100nF  C-EUC0805K  [C0805K]
C32  100uF / 50V  CPOL-EUF  [PANASONIC_F]
C33  100uF / 50V  CPOL-EUF  [PANASONIC_F]
C34  100uF / 50V  CPOL-EUF  [PANASONIC_F]
C35  100nF  C-EUC0805K  [C0805K]
C36  100nF  C-EUC0805K  [C0805K]
D2  SM6T27AY  SCHOTTKY-DIODESMD  [SMB]
D3  SM6T27AY  SCHOTTKY-DIODESMD  [SMB]
D4  DIODE-SOD123  [SOD123]
D5  DIODE-SOD123  [SOD123]
D6  SMAJ15A-TR  DIODESMA  [SMADIODE]
L4  FERROCORE HPI0530-100  MS85  [MS85]
R49  VAR7-30  VARISTORS07K11  [S07K11]
R50  ECE RB300-30  VARISTORS07K11  [S07K11]
R51  VAR7-30  VARISTORS07K11  [S07K11]
R52  100  R-EU_R0805  [R0805]
SJ1  SJ  [SJ]
TP1  3V3  TPTP18SQ  [TP18SQ]
TP2  5V  TPTP18SQ  [TP18SQ]
TP3  12V  TPTP18SQ  [TP18SQ]
TP4  GND  TPTP18SQ  [TP18SQ]
U4  3.3V  FDSM_SIP-3_173010542  [FDSM-173XXXX42]
U5  5V  FDSM_SIP-3_173010542  [FDSM-173XXXX42]
V1  TME0515S  [TME]
X3  HEADER_POS4_43045-0412  [43045-0412]
X4  HEADER_POS4_43045-0412  [43045-0412]

### Nets
+3V3: C32.+ C35.2 TP1.TP U4.3(VOUT) ; also sheet 1,3,5,6,7,8
+5V: C23.+ C25.2 C33.+ C36.2 TP2.TP U5.3(VOUT) V1.2(+VIN) ; also sheet 1,2,3,5
+12V: SJ1.2 ; also sheet 7,8
GND: C23.- C24.2 C25.1 C26.- C27.- C28.2 C29.1 C30.1 C31.1 C32.- C33.- C34.- C35.1 C36.1 D2.A D6.A R49.2 R51.2 R52.2 TP4.TP U4.2(GND) U5.2(GND) V1.1(-VIN) V1.3(-VOUT) X3.P$2 X4.P$2 ; also sheet 1,2,3,5,6,7,8
N$8: C27.+ C28.1 C29.2 C30.2 C31.2 L4.2 U4.1(VIN) U5.1(VIN)
N$11: D2.C D3.A R50.1 R51.1
N$13: D4.A V1.4(+VOUT)
N$20: D4.C D5.A
N$21: C24.1 C26.+ D3.C L4.1
N$36: C34.+ D5.C D6.C R52.1 SJ1.1 TP3.TP
N$46: X3.P$4 X4.P$4
N$48: X3.P$3 X4.P$3
N$177: R49.1 R50.2 X3.P$1 X4.P$1

### Notes on the sheet
- +3.3V
- +5V
- +13V
- GND

## Sheet 5 of 8: WS2812B controller
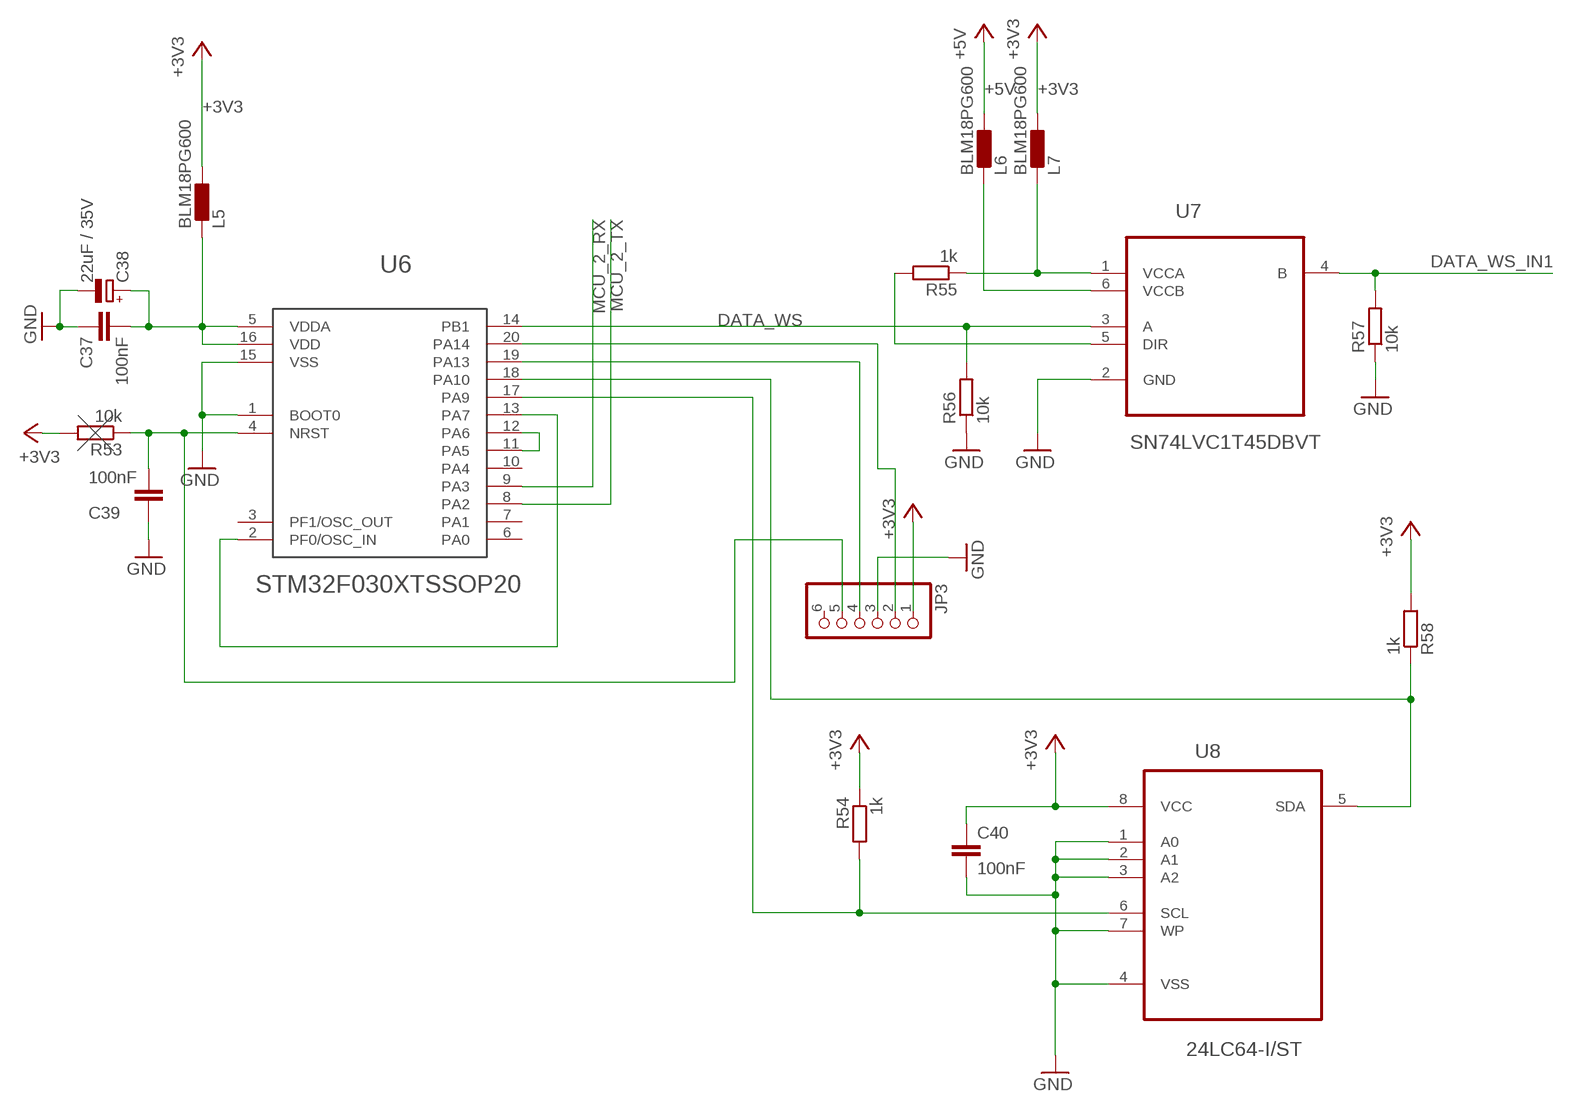
[diagram p5: schematic, sheet 5]

### Parts
C37  100nF  C-EUC0805K  [C0805K]
C38  22uF / 35V  CPOL-EUSMCD  [SMC_D]
C39  100nF  C-EUC0805K  [C0805K]
C40  100nF  C-EUC0805K  [C0805K]
JP3  PINHD-1X6  [1X06]
L5  BLM18PG600  L_EU_L0603  [L1608]
L6  BLM18PG600  L_EU_L0603  [L1608]
L7  BLM18PG600  L_EU_L0603  [L1608]
R53  10k  R-EU_R0805  [R0805]
R54  1k  R-EU_R0805  [R0805]
R55  1k  R-EU_R0805  [R0805]
R56  10k  R-EU_R0805  [R0805]
R57  10k  R-EU_R0805  [R0805]
R58  1k  R-EU_R0805  [R0805]
U6  STM32F030XTSSOP20  [TSSOP-20]
U7  SN74LVC1T45DBVT  [SOT95P280X145-6N]
U8  24LC64-I/ST  [SOP65P638X110-8N]

### Nets
+3V3: C40.1 JP3.1 L5.1 L7.1 R53.2 R54.1 R58.2 U8.8(VCC) ; also sheet 1,3,4,6,7,8
+5V: L6.1 ; also sheet 1,2,3,4
DATA_WS: R56.2 U6.14(PB1) U7.3(A)
DATA_WS_IN1: R57.2 U7.4(B) ; also sheet 2
GND: C37.1 C38.- C39.1 C40.2 JP3.3 R56.1 R57.1 U6.1(BOOT0) U6.15(VSS) U7.2(GND) U8.1(A0) U8.2(A1) U8.3(A2) U8.4(VSS) U8.7(WP) ; also sheet 1,2,3,4,6,7,8
MCU_2_RX: U6.9(PA3) ; also sheet 1
MCU_2_TX: U6.8(PA2) ; also sheet 1
N$96: R55.2 U7.5(DIR)
N$97: L7.2 R55.1 U7.1(VCCA)
N$101: L6.2 U7.6(VCCB)
N$105: C39.2 JP3.5 R53.1 U6.4(NRST)
N$106: U6.2(PF0/OSC_IN) U6.13(PA7)
N$107: U6.11(PA5) U6.12(PA6)
N$109: JP3.4 U6.19(PA13)
N$110: JP3.2 U6.20(PA14)
N$111: R58.1 U6.18(PA10) U8.5(SDA)
N$112: R54.2 U6.17(PA9) U8.6(SCL)
N$120: C37.2 C38.+ L5.2 U6.5(VDDA) U6.16(VDD)
Unconnected: JP3.6 U6.3(PF1/OSC_OUT) U6.6(PA0) U6.7(PA1) U6.10(PA4)

## Sheet 6 of 8: OLED Displays I
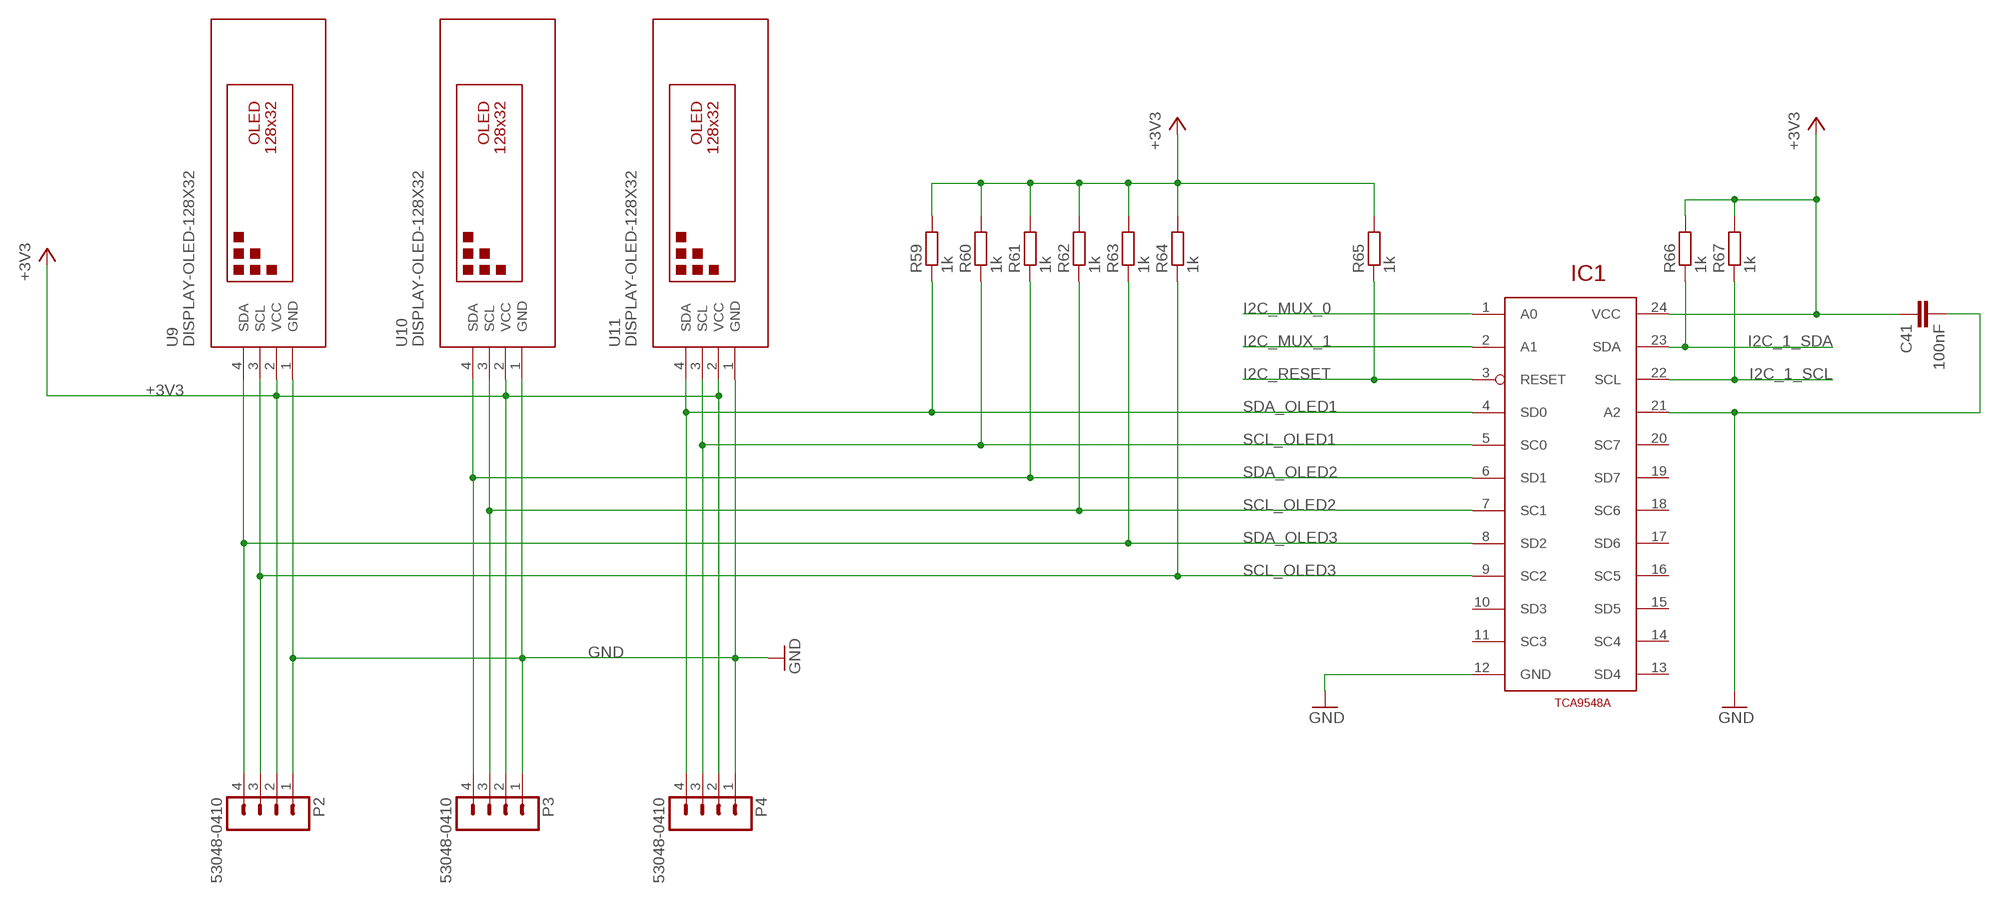
[diagram p6: schematic, sheet 6]

### Parts
C41  100nF  C-EUC0805K  [C0805K]
IC1  TCA9548A  [TSSOP24]
P2  53048-0410  [53048-0410]
P3  53048-0410  [53048-0410]
P4  53048-0410  [53048-0410]
R59  1k  R-EU_R0805  [R0805]
R60  1k  R-EU_R0805  [R0805]
R61  1k  R-EU_R0805  [R0805]
R62  1k  R-EU_R0805  [R0805]
R63  1k  R-EU_R0805  [R0805]
R64  1k  R-EU_R0805  [R0805]
R65  1k  R-EU_R0805  [R0805]
R66  1k  R-EU_R0805  [R0805]
R67  1k  R-EU_R0805  [R0805]
U9  DISPLAY-OLED-128X32  [DISPLAY-OLED-128X32]
U10  DISPLAY-OLED-128X32  [DISPLAY-OLED-128X32]
U11  DISPLAY-OLED-128X32  [DISPLAY-OLED-128X32]

### Nets
+3V3: C41.1 IC1.24(VCC) P2.2 P3.2 P4.2 R59.2 R60.2 R61.2 R62.2 R63.2 R64.2 R65.2 R66.2 R67.2 U9.2(VCC) U10.2(VCC) U11.2(VCC) ; also sheet 1,3,4,5,7,8
GND: C41.2 IC1.12(GND) IC1.21(A2) P2.1 P3.1 P4.1 U9.1(GND) U10.1(GND) U11.1(GND) ; also sheet 1,2,3,4,5,7,8
I2C_1_SCL: IC1.22(SCL) R67.1 ; also sheet 1
I2C_1_SDA: IC1.23(SDA) R66.1 ; also sheet 1
I2C_MUX_0: IC1.1(A0) ; also sheet 1
I2C_MUX_1: IC1.2(A1) ; also sheet 1
I2C_RESET: IC1.3(RESET) R65.1 ; also sheet 1
SCL_OLED1: IC1.5(SC0) P4.3 R60.1 U11.3(SCL)
SCL_OLED2: IC1.7(SC1) P3.3 R62.1 U10.3(SCL)
SCL_OLED3: IC1.9(SC2) P2.3 R64.1 U9.3(SCL)
SDA_OLED1: IC1.4(SD0) P4.4 R59.1 U11.4(SDA)
SDA_OLED2: IC1.6(SD1) P3.4 R61.1 U10.4(SDA)
SDA_OLED3: IC1.8(SD2) P2.4 R63.1 U9.4(SDA)
Unconnected: IC1.10(SD3) IC1.11(SC3) IC1.13(SD4) IC1.14(SC4) IC1.15(SD5) IC1.16(SC5) IC1.17(SD6) IC1.18(SC6) IC1.19(SD7) IC1.20(SC7)

## Sheet 7 of 8: OLED Displays II
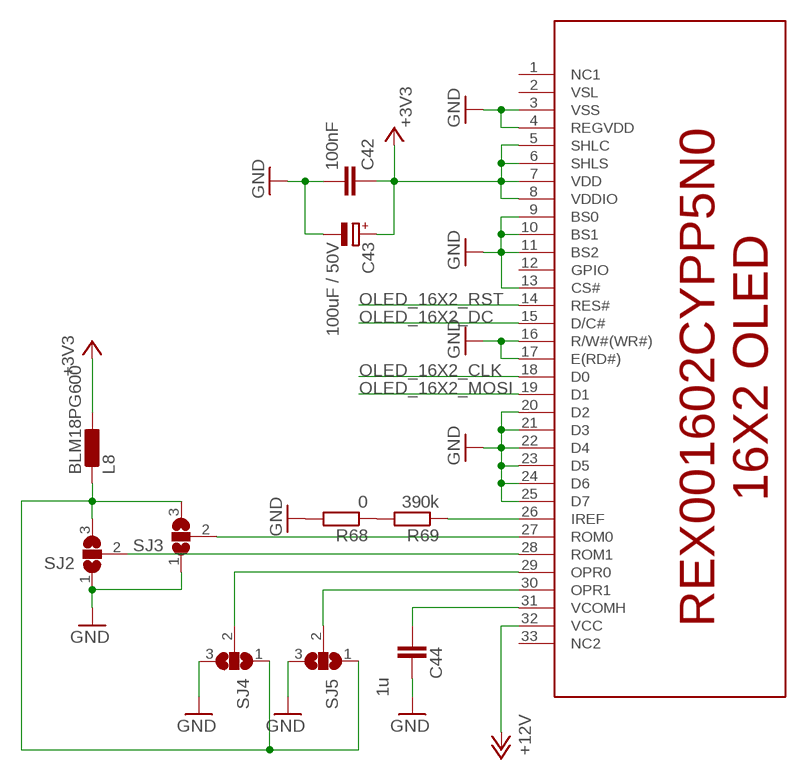
[diagram p7: schematic, sheet 7]

### Parts
C42  100nF  C-EUC0805K  [C0805K]
C43  100uF / 50V  CPOL-EUF  [PANASONIC_F]
C44  1u  C-EUC0805K  [C0805K]
DISPLAY1  REX001602CYPP5N0  [33PIN_LCD16X2]
L8  BLM18PG600  L_EU_L0603  [L1608]
R68  0  R-EU_R0805  [R0805]
R69  390k  R-EU_R0805  [R0805]
SJ2  SJ2W  [SJ_2]
SJ3  SJ2W  [SJ_2]
SJ4  SJ2W  [SJ_2]
SJ5  SJ2W  [SJ_2]

### Nets
+3V3: C42.1 C43.+ DISPLAY1.5(SHLC) DISPLAY1.6(SHLS) DISPLAY1.7(VDD) DISPLAY1.8(VDDIO) L8.1 ; also sheet 1,3,4,5,6,8
+12V: DISPLAY1.32(VCC) ; also sheet 4,8
GND: C42.2 C43.- C44.1 DISPLAY1.3(VSS) DISPLAY1.4(REGVDD) DISPLAY1.9(BS0) DISPLAY1.10(BS1) DISPLAY1.11(BS2) DISPLAY1.13(CS#) DISPLAY1.16(R/W#(WR#)) DISPLAY1.17(E(RD#)) DISPLAY1.20(D2) DISPLAY1.21(D3) DISPLAY1.22(D4) DISPLAY1.23(D5) DISPLAY1.24(D6) DISPLAY1.25(D7) R68.2 SJ2.1 SJ3.1 SJ4.3 SJ5.3 ; also sheet 1,2,3,4,5,6,8
N$63: DISPLAY1.26(IREF) R69.1
N$89: R68.1 R69.2
N$95: DISPLAY1.27(ROM0) SJ3.2
N$98: DISPLAY1.28(ROM1) SJ2.2
N$99: C44.2 DISPLAY1.31(VCOMH)
N$100: L8.2 SJ2.3 SJ3.3 SJ4.1 SJ5.1
N$102: DISPLAY1.30(OPR1) SJ5.2
N$103: DISPLAY1.29(OPR0) SJ4.2
OLED_16X2_CLK: DISPLAY1.18(D0) ; also sheet 1
OLED_16X2_DC: DISPLAY1.15(D/C#) ; also sheet 1
OLED_16X2_MOSI: DISPLAY1.19(D1) ; also sheet 1
OLED_16X2_RST: DISPLAY1.14(RES#) ; also sheet 1
Unconnected: DISPLAY1.1(NC1) DISPLAY1.2(VSL) DISPLAY1.12(GPIO) DISPLAY1.33(NC2)

## Sheet 8 of 8: OLED Displays III
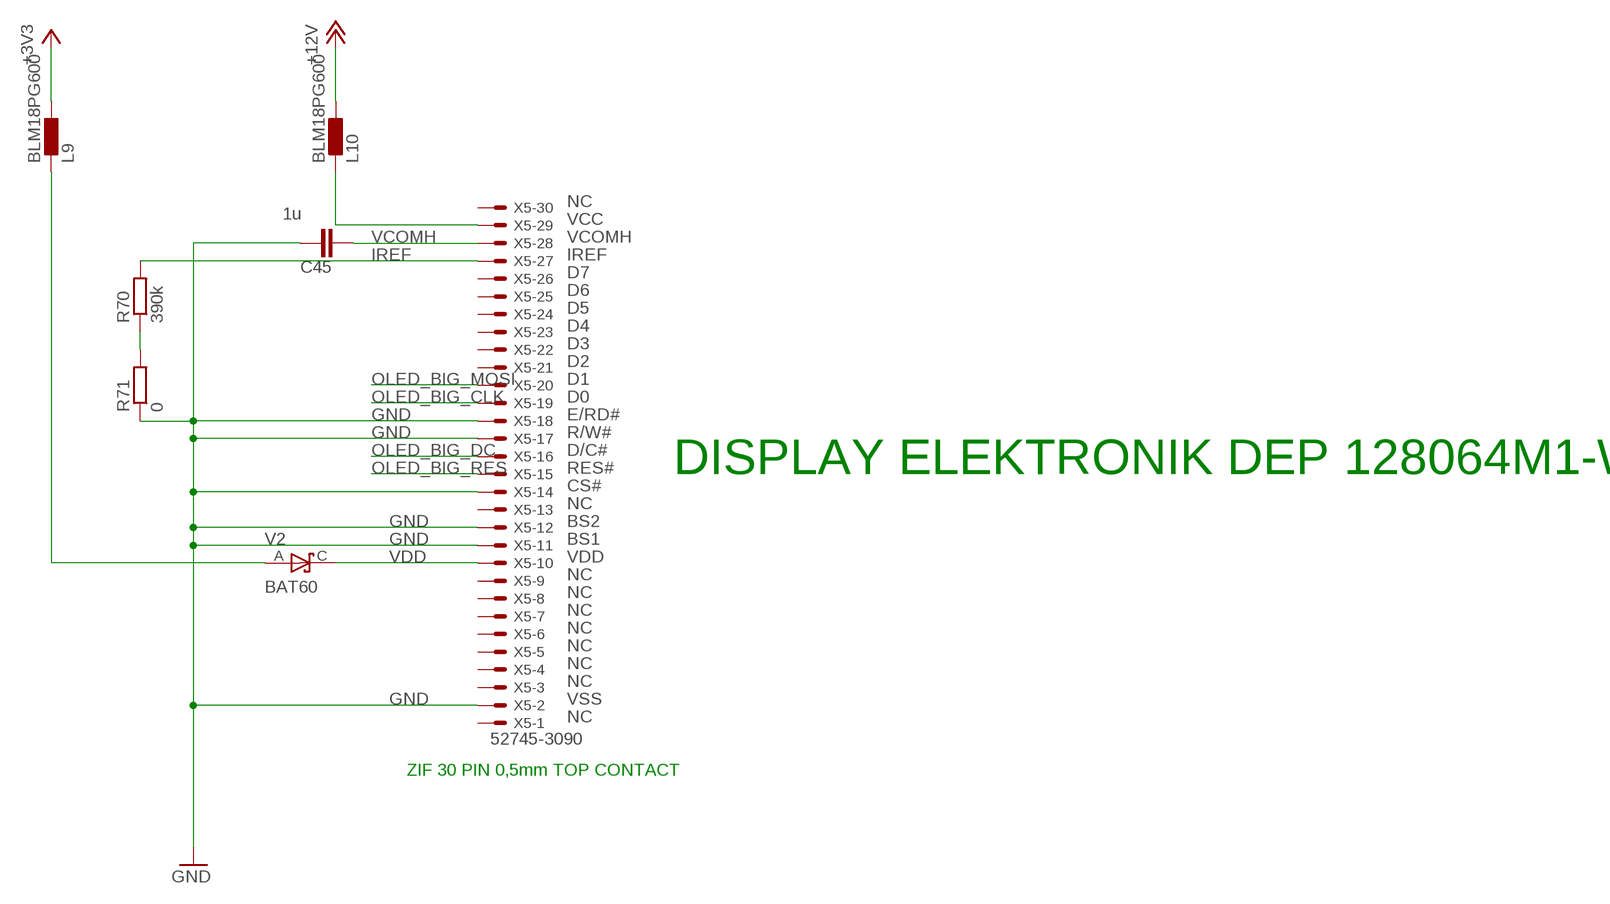
[diagram p8: schematic, sheet 8]

### Parts
C45  1u  C-EUC0805K  [C0805K]
L9  BLM18PG600  L_EU_L0603  [L1608]
L10  BLM18PG600  L_EU_L0603  [L1608]
R70  390k  R-EU_R0805  [R0805]
R71  0  R-EU_R0805  [R0805]
V2  BAT60  [SOD323-R]
X5  52745-3090  [52745-3090]

### Nets
+3V3: L9.1 ; also sheet 1,3,4,5,6,7
+12V: L10.1 ; also sheet 4,7
GND: C45.1 R71.1 X5.2 X5.11 X5.12 X5.14 X5.17 X5.18 ; also sheet 1,2,3,4,5,6,7
IREF: R70.2 X5.27
N$24: L10.2 X5.29
N$30: L9.2 V2.A
N$90: R70.1 R71.2
OLED_BIG_CLK: X5.19 ; also sheet 1
OLED_BIG_DC: X5.16 ; also sheet 1
OLED_BIG_MOSI: X5.20 ; also sheet 1
OLED_BIG_RES: X5.15 ; also sheet 1
VCOMH: C45.2 X5.28
VDD: V2.C X5.10
Unconnected: X5.1 X5.3 X5.4 X5.5 X5.6 X5.7 X5.8 X5.9 X5.13 X5.21 X5.22 X5.23 X5.24 X5.25 X5.26 X5.30

### Notes on the sheet
- NC
- VCC
- VCOMH
- IREF
- D7
- D6
- D5
- D4
- D3
- D2
- D1
- D0
- E/RD#
- R/W#
- D/C#
- RES# | DISPLAY ELEKTRONIK DEP 128064M1-W
- CS#
- NC
- BS2
- BS1
- VDD
- NC
- NC
- NC
- NC
- NC
- NC
- NC
- VSS
- NC
- ZIF 30 PIN 0,5mm TOP CONTACT

## Library data of the parts
C1 C4 C7 C23 C26 C27 C32-C34 C38 C43 = rcl:CPOL-EU: POLARIZED CAPACITOR, European symbol; SPICEPREFIX: C
C2 C3 C5 C6 C8-C22 C24 C25 C28-C31 C35-C37 C39-C42 = rcl:C-EU: CAPACITOR, European symbol; SPICEPREFIX: C
C44 C45 = HMI_OLED-V1:C-EU: CAPACITOR, European symbol
D1 = diode:PESD1CAN: CAN bus ESD protection diode Source: http://www.nxp.com/documents/data_sheet/PESD1CAN.pdf
D2 D3 = diode:SCHOTTKY-DIODE: Schottky Diode
D4 D5 = diode:DIODE-: DIODE
D6 = adafruit:DIODE: Diode SMADIODE - SMA Surface Mount Package 20V 1A Schottky Diode Digikey: 641-1014-6-ND DO-1N4148 - Through Hole Small Current Diode SOD-123 20V 1 A (.5mV Vf) Schottky Diode - Digikey: MBRX120TPMSCT-ND SOD-323 10V 570mA (.38mV Vf, 3ns) Schottky Diode - Digikey: ZLLS410CT-ND SOD-523 30V 30mA Schottky Diode (RB751S-40TE61) - Digikey: RB751S-40TE61CT-ND SOT23-R/W - SOT23 Package (R = Solder Paste/Reflow Ovens, W = Hand-Soldering) BAT54Film 40V 300mA - Digikey: 497-7162-1-ND
DISPLAY1 = Dashboard_displays:REX001602CYPP5N0
IC1 = tca9548a:TCA9548A
JP1 JP3 = pinhead:PINHD-1X6: PIN HEADER
JP2 = pinhead:PINHD-1X4: PIN HEADER
L1-L3 L5-L10 = PDFerr:L_EU_
L4 = inductor-neosid:MS85: INDUCTOR SMD power inductor; OC_FARNELL: unknown; OC_NEWARK: unknown
LED1-LED37 = XMC4500_Relax-V1:LED: LED OSRAM: - CHIPLED LG R971, LG N971, LY N971, LG Q971, LY Q971, LO R971, LY R971 LH N974, LH R974 LS Q976, LO Q976, LY Q976 LO Q996 - Hyper CHIPLED LW Q18S LB Q993, LB Q99A, LB R99A - SideLED LS A670, LO A670, LY A670, LG A670, LP A670 LB A673, LV A673, LT A673, LW A673 LH A674 LY A675 LS A676, LA A676, LO A676, LY A676, LW A676 LS A679, LY A679, LG A679 - Hyper Micro SIDELED® LS Y876, LA Y876, LO Y876, LY Y876 LT Y87S - SmartLED LW L88C, LW L88S LB L89C, LB L89S, LG L890 LS L89K, LO L89K, LY L89K LS L896, LA L896, LO L896, LY L896 - TOPLED LS T670, LO T670, LY T670, LG T670, LP T670 LSG T670, LSP T670, LSY T670, LOP T670, LYG T670 LG T671, LOG T671, LSG T671 LB T673, LV T673, LT T673, LW T673 LH T674 LS T676, LA T676, LO T676, LY T676, LB T676, LH T676, LSB T676, LW T676 LB T67C, LV T67C, LT T67C, LS T67K, LO T67K, LY T67K, LW E67C LS E67B, LA E67B, LO E67B, LY E67B, LB E67C, LV E67C, LT E67C LW T67C LS T679, LY T679, LG T679 LS T770, LO T770, LY T770, LG T770, LP T770 LB T773, LV T773, LT T773, LW T773 LH T774 LS E675, LA E675, LY E675, LS T675 LS T776, LA T776, LO T776, LY T776, LB T776 LHGB T686 LT T68C, LB T68C - Hyper Mini TOPLED® LB M676 - Mini TOPLED Santana® LG M470 LS M47K, LO M47K, LY M47K Source: http://www.osram.convergy.de - LUMILED® LXK2-PW12-R00, LXK2-PW12-S00, LXK2-PW14-U00, LXK2-PW14-V00 LXK2-PM12-R00, LXK2-PM12-S00, LXK2-PM14-U00 LXK2-PE12-Q00, LXK2-PE12-R00, LXK2-PE12-S00, LXK2-PE14-T00, LXK2-PE14-U00 LXK2-PB12-K00, LXK2-PB12-L00, LXK2-PB12-M00, LXK2-PB14-N00, LXK2-PB14-P00, LXK2-PB14-Q00 LXK2-PR12-L00, LXK2-PR12-M00, LXK2-PR14-Q00, LXK2-PR14-R00 LXK2-PD12-Q00, LXK2-PD12-R00, LXK2-PD12-S00 LXK2-PH12-R00, LXK2-PH12-S00 LXK2-PL12-P00, LXK2-PL12-Q00, LXK2-PL12-R00 Source: www.luxeon.com
P1 = con-molex-picoblade:53048-0210: HEADER
P2-P4 = con-molex-picoblade:53048-0410: HEADER
PD1-PD16 = WS2812B:WS2812B: WS2812B - Intelligent control LED integrated light source Technical Specifications: Power Supply Voltage (VDD): 3.5 to 5.3 V Input Voltage (VI): -0.5 to VDD+0.5 V Operating Junction Temperature (Topt): -25°C to +80°C Storage Temperature Range (Tstg): -55°C to +150°C; AVAILABILITY: Unavailable; DESCRIPTION: Intelligent Control Led Integrated Light Source Pack Of 10; MF: Adafruit Industries; MP: WS2812B; PACKAGE: None; PRICE: 5.56 USD
PD17-PD110 = WS2812B:WS2812B: WS2812B - Intelligent control LED integrated light source Technical Specifications: Power Supply Voltage (VDD): 3.5 to 5.3 V Input Voltage (VI): -0.5 to VDD+0.5 V Operating Junction Temperature (Topt): -25°C to +80°C Storage Temperature Range (Tstg): -55°C to +150°C
Q1 = crystal:CRYSTAL: CRYSTAL; OC_FARNELL: unknown; OC_NEWARK: unknown
Q2 = XMC4500_Relax-V1:MC-306
R1-R48 R52-R71 = rcl:R-EU_: RESISTOR, European symbol; SPICEPREFIX: R
R49-R51 = varistor:VARISTOR: VARISTOR
SJ1 = jumper:SJ: SMD solder JUMPER
SJ2-SJ5 = jumper:SJ2W: SMD solder JUMPER
T1-T3 = transistor-neu-to92:*-NPN-: NPN Transistror
TP1-TP4 = testpad:TP: Test pad
U1 = TLE7251:TLE7251V
U2 = DFPlayer_v1:DFPLAYER
U3 = ST Microelctronics_By_element14_Batch_1:STM32F103RET6: ARM-based 32-bit MCU; MPN: STM32F103RET6; OC_FARNELL: 1624138; OC_NEWARK: 01P4101; PACKAGE: QFP-64; SUPPLIER: STMICROELECTRONICS
U4 U5 = Eagle_STEP-DOWN-CONVERTER (rev18b):FDSM_SIP-3: MagI³C-FDSM Fixed Step Down Regulator Module Characteristics Simplest design (no power supply knowledge required) Leaded through-hole package for easy manufacturing and prototyping Stand alone solution (CIN and COUT integrated, no external components) L78x series linear regulator replacement (no heatsink required) Low conducted and radiated EMI (compliant to EN55022 class B) Applications Point-of-Load from 24V, 18V, 15V, 12V, 9V rail Replacement for linear regulators Interface and microcontroller supply Industrial, Test & Measurement, Medical applications System power supplies <http://katalog.we-online.de/media/images/v2/Family_MAGIC-FDSM_173950x378.jpg> Details see: http://katalog.we-online.de/pm/datasheet/173010378.pdf 2015 (C) Wurth Elektronik
U6 = stm32f030x:STM32F030X
U7 = SN74LVC1T45DBVT:SN74LVC1T45DBVT: BUS Transceiver; AVAILABILITY: Unavailable; DESCRIPTION: Single-Bit Dual-Supply Bus Transceiver with Configurable Voltage Translation and 3-State Outputs 6-SOT-23 -40 to 85; MF: Texas Instruments; MP: SN74LVC1T45DBVT; PACKAGE: SOT-23-6 Texas Instruments; PRICE: None
U8 = 24LC64-I_ST:24LC64-I/ST: 64K I2C Serial EEPROM; AVAILABILITY: Unavailable; DESCRIPTION: 24LC64 Series 64 Kb I2C 2 Wire _8K X 8_ 2.5 V Serial EEPROM SMT - TSSOP-8; MF: Microchip; MP: 24LC64-I/ST; PACKAGE: TSSOP-8 Microchip; PRICE: None
U9-U11 = diy-modules:DISPLAY-OLED-128X32: 128x32 Dot Matrix OLED Module with I2C interface based on SSD1306 chip More details available here: http://www.tinyosshop.com/index.php?route=product/product&product_id=953 Schematic available here: http://www.tinyosshop.com/datasheet/OLED%2012832.pdf SSD1306 datasheet: https://cdn-shop.adafruit.com/datasheets/SSD1306.pdf Click here to find device on ebay.com <http://www.ebay.com/sch/oled+display+128x32+i2c>
V1 = traco-electronic:TME?*: DC/DC Converter TME Series 1 Watt Source: www.tracopower.com .. tme.pdf; MPN: TME 0515S; OC_FARNELL: 1007541; OC_NEWARK: 51R5324
V2 = XMC4500_Relax-V1:BAT60
X1 X2 = con-molex-micro-fit-3_0:HEADER_POS3_?: Molex - Micro-Fit 3.0 Series connector, 3.00mm (0.118") pitch header, 3 positions.
X3 X4 = con-molex-micro-fit-3_0:HEADER_POS4_?: Molex - Micro-Fit 3.0 Series connector, 3.00mm (0.118") pitch header, 4 positions.
X5 = con-molex:52745-3090: FFC/FPC-to-Board 0.50mm (.020") SMT Top Contact Right Angle, ZIF, Style Receptacle 52745 / 52435 Source: http://www.molex.com/product/ffc/52745.html; MF: MOLEX; OC_FARNELL: unknown; OC_NEWARK: unknown